# Altium project Wolf-Lite M.PrjPcb (part 2 of 2)

## Sheet WL-CPU.SchDoc
size 420 x 297 mm; Scale: 1:1; DocumentType: Схема электрическая принципиальная; FirstReferrence: UA3REO/R7KBI; SheetNumber: 2; SheetTotal: 12
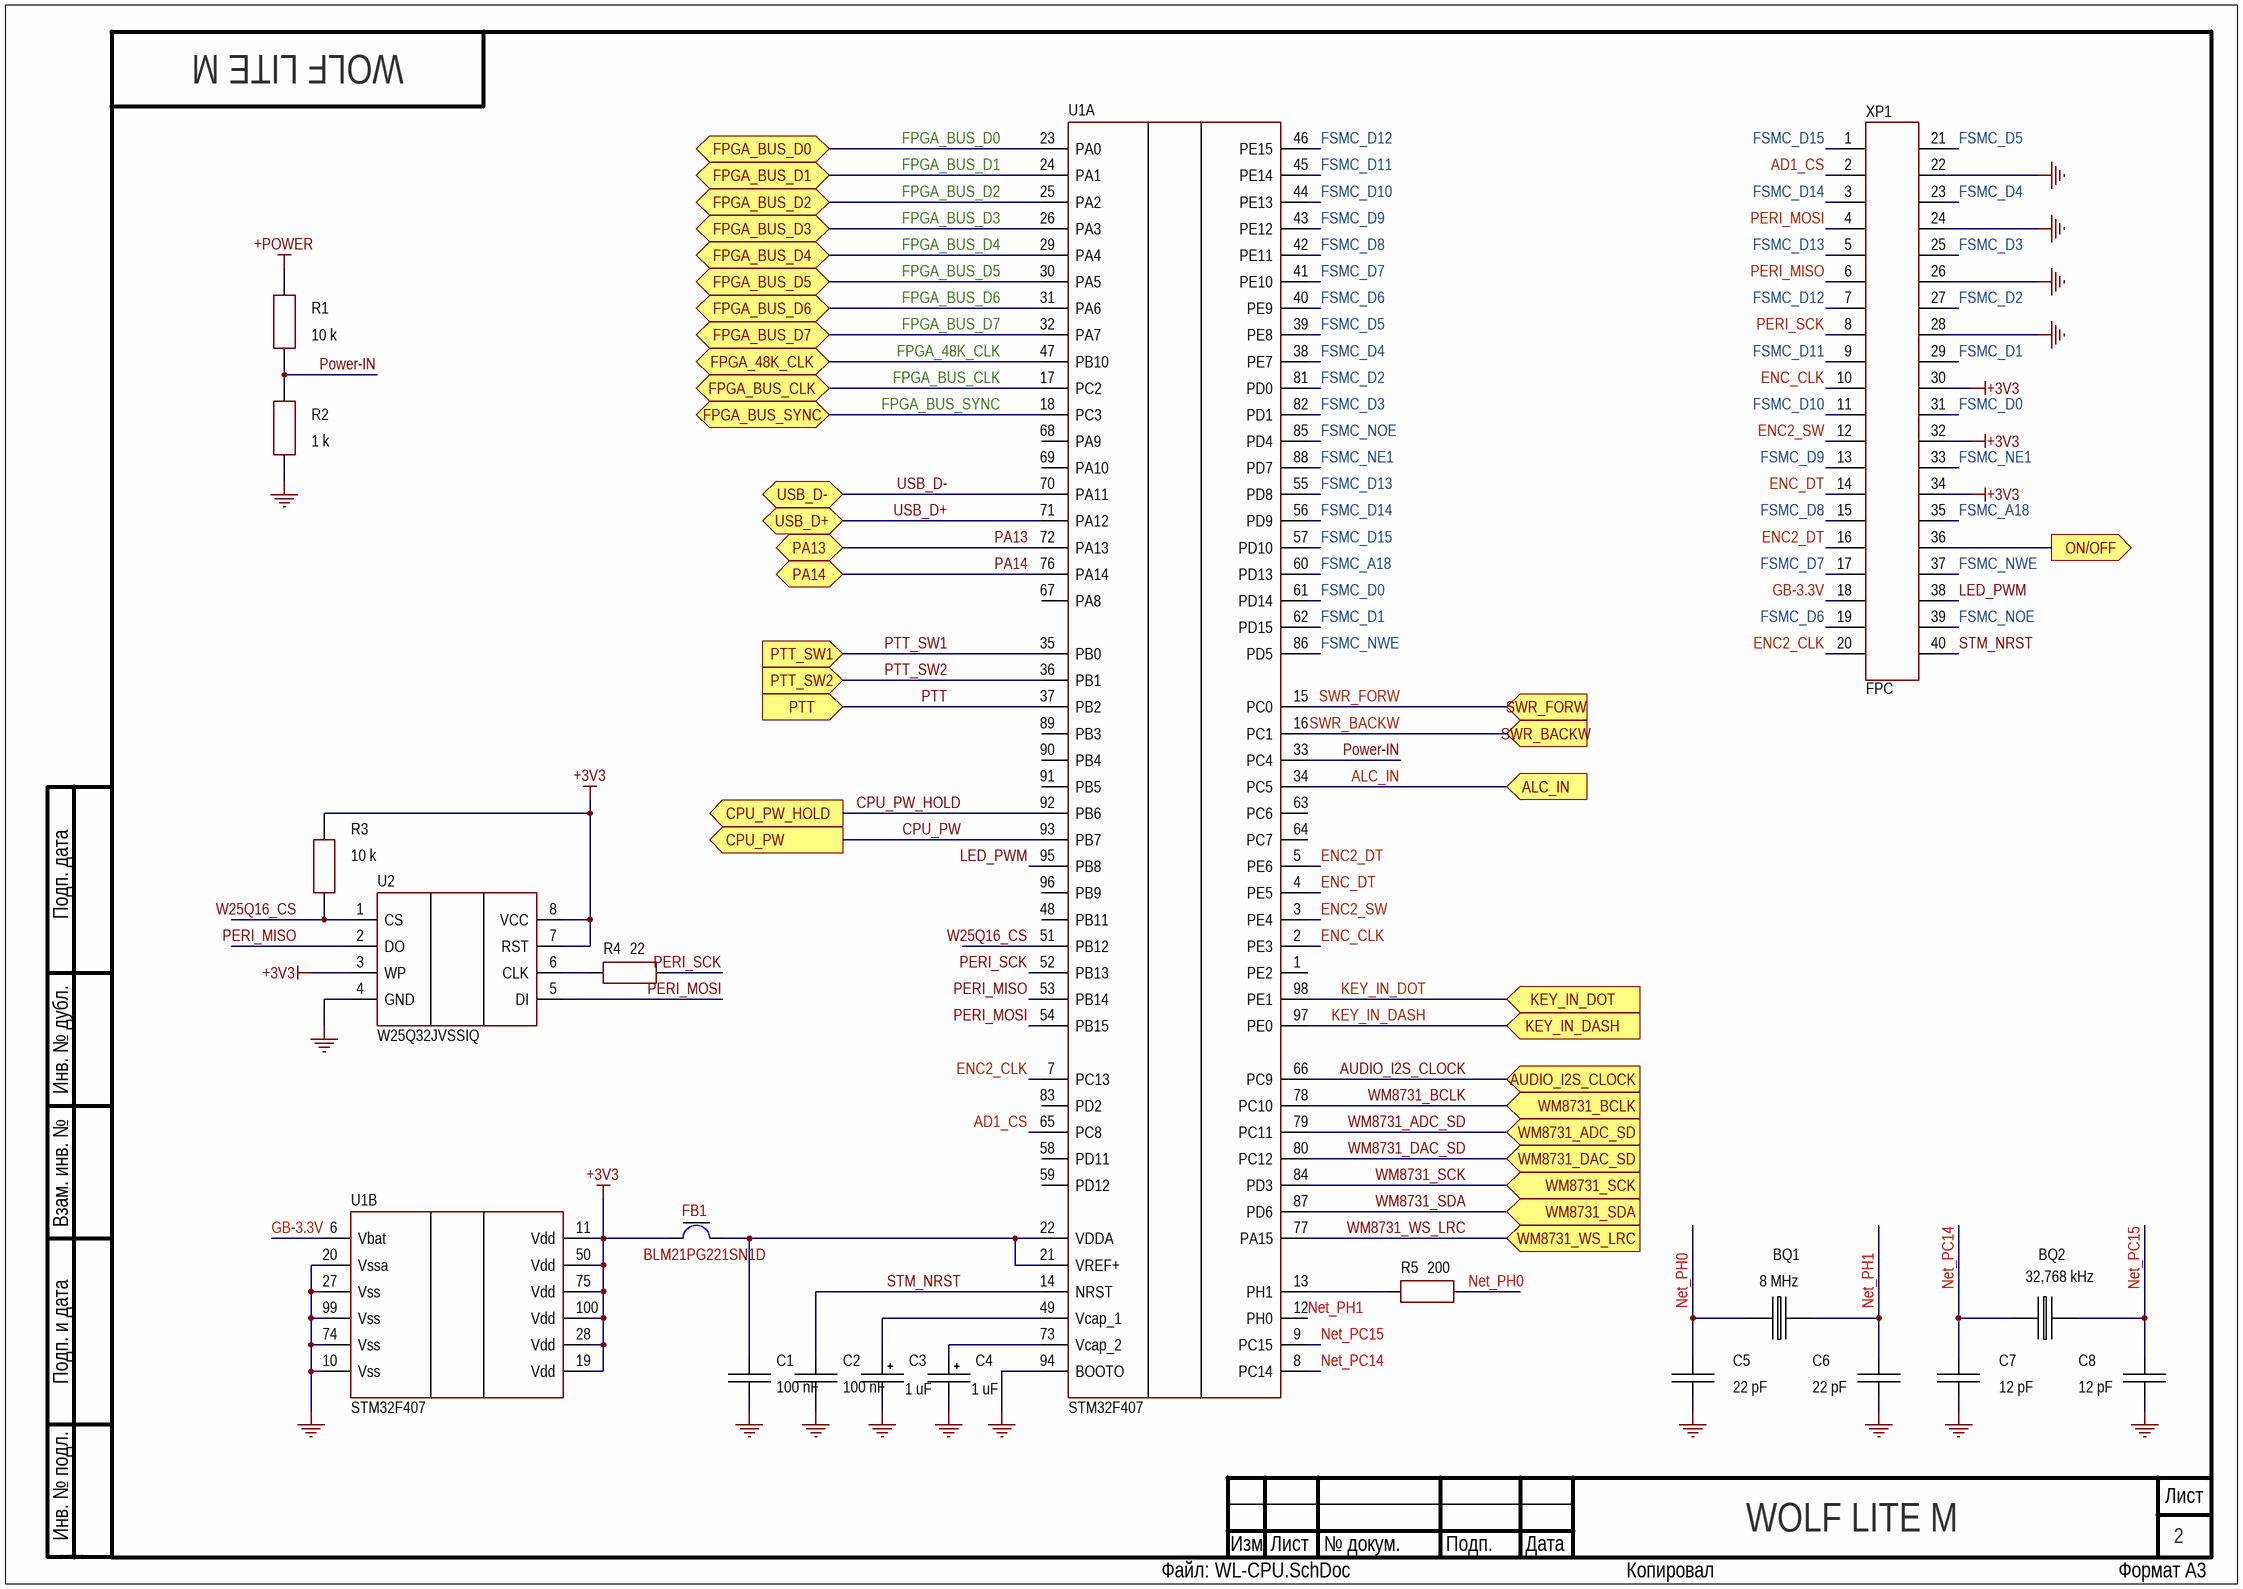
[diagram p6: WL-CPU.SchDoc]

### Parts
BQ1  8 MHz  [SMD-4-CRYSTAL]
BQ2  32,768 kHz  [SOJ-4]
C1  100 nF  [C-0805-0.95]
C2  100 nF  [C-0805-0.95]
C3  1 uF  [CAP-CASE B]
C4  1 uF  [CAP-CASE B]
C5  22 pF  [C-0805-0.7]
C6  22 pF  [C-0805-0.7]
C7  12 pF  [C-0805-0.7]
C8  12 pF  [C-0805-0.7]
FB1  BLM21PG221SN1D  [L-0805]
R1  10 k  [R-0805]
R2  1 k  [R-0805]
R3  10 k  [R-0805]
R4  22  [R-0805]
R5  200  [R-0805]
U1  STM32F407  [LQFP-100]  (parts A,B of 2)
U2  W25Q32JVSSIQ  [SOIC-8-W]
XP1  FPC  [FPC-40-05-V]

### Ports
ALC_IN (in), AUDIO_I2S_CLOCK (in), CPU_PW (out), CPU_PW_HOLD (out), FPGA_48K_CLK (bidir), FPGA_BUS_CLK (bidir), FPGA_BUS_D0 (bidir), FPGA_BUS_D1 (bidir), FPGA_BUS_D2 (bidir), FPGA_BUS_D3 (bidir), FPGA_BUS_D4 (bidir), FPGA_BUS_D5 (bidir), FPGA_BUS_D6 (bidir), FPGA_BUS_D7 (bidir), FPGA_BUS_SYNC (bidir), KEY_IN_DASH (in), KEY_IN_DOT (in), ON/OFF (out), PA13 (bidir), PA14 (bidir), PTT (in), PTT_SW1 (in), PTT_SW2 (in), SWR_BACKW (in), SWR_FORW (in), USB_D+ (bidir), USB_D- (bidir), WM8731_ADC_SD (in), WM8731_BCLK (in), WM8731_DAC_SD (in), WM8731_SCK (in), WM8731_SDA (in), WM8731_WS_LRC (in)

### Nets
+3V3: FB1.2 R3.2 U1.11(Vdd) U1.19(Vdd) U1.28(Vdd) U1.50(Vdd) U1.75(Vdd) U1.100(Vdd) U2.3(WP) U2.7(RST) U2.8(VCC) XP1.30 XP1.32 XP1.34
+Power: R1.2
GND: C1.2 C2.1 C3.2 C4.2 C5.1 C6.1 C7.1 C8.1 R2.1 U1.10(Vss) U1.20(Vssa) U1.27(Vss) U1.74(Vss) U1.94(BOOTO) U1.99(Vss) U2.4(GND) XP1.22 XP1.24 XP1.26 XP1.28
AD1_CS: U1.65(PC8) XP1.2
ALC_IN: U1.34(PC5) ; port ALC_IN
AUDIO_I2S_CLOCK: U1.66(PC9) ; port AUDIO_I2S_CLOCK
CPU_PW: U1.93(PB7) ; port CPU_PW
CPU_PW_HOLD: U1.92(PB6) ; port CPU_PW_HOLD
ENC2_CLK: U1.7(PC13) XP1.20
ENC2_DT: U1.5(PE6) XP1.16
ENC2_SW: U1.3(PE4) XP1.12
ENC_CLK: U1.2(PE3) XP1.10
ENC_DT: U1.4(PE5) XP1.14
FPGA_48K_CLK: U1.47(PB10) ; port FPGA_48K_CLK
FPGA_BUS_CLK: U1.17(PC2) ; port FPGA_BUS_CLK
FPGA_BUS_D0: U1.23(PA0) ; port FPGA_BUS_D0
FPGA_BUS_D1: U1.24(PA1) ; port FPGA_BUS_D1
FPGA_BUS_D2: U1.25(PA2) ; port FPGA_BUS_D2
FPGA_BUS_D3: U1.26(PA3) ; port FPGA_BUS_D3
FPGA_BUS_D4: U1.29(PA4) ; port FPGA_BUS_D4
FPGA_BUS_D5: U1.30(PA5) ; port FPGA_BUS_D5
FPGA_BUS_D6: U1.31(PA6) ; port FPGA_BUS_D6
FPGA_BUS_D7: U1.32(PA7) ; port FPGA_BUS_D7
FPGA_BUS_SYNC: U1.18(PC3) ; port FPGA_BUS_SYNC
FSMC_A18: U1.60(PD13) XP1.35
FSMC_D0: U1.61(PD14) XP1.31
FSMC_D1: U1.62(PD15) XP1.29
FSMC_D2: U1.81(PD0) XP1.27
FSMC_D3: U1.82(PD1) XP1.25
FSMC_D4: U1.38(PE7) XP1.23
FSMC_D5: U1.39(PE8) XP1.21
FSMC_D6: U1.40(PE9) XP1.19
FSMC_D7: U1.41(PE10) XP1.17
FSMC_D8: U1.42(PE11) XP1.15
FSMC_D9: U1.43(PE12) XP1.13
FSMC_D10: U1.44(PE13) XP1.11
FSMC_D11: U1.45(PE14) XP1.9
FSMC_D12: U1.46(PE15) XP1.7
FSMC_D13: U1.55(PD8) XP1.5
FSMC_D14: U1.56(PD9) XP1.3
FSMC_D15: U1.57(PD10) XP1.1
FSMC_NE1: U1.88(PD7) XP1.33
FSMC_NOE: U1.85(PD4) XP1.39
FSMC_NWE: U1.86(PD5) XP1.37
GB-3.3V: U1.6(Vbat) XP1.18
KEY_IN_DASH: U1.97(PE0) ; port KEY_IN_DASH
KEY_IN_DOT: U1.98(PE1) ; port KEY_IN_DOT
LED_PWM: U1.95(PB8) XP1.38
Net_PC14: BQ2.1 C7.2 U1.8(PC14)
Net_PC15: BQ2.4 C8.2 U1.9(PC15)
Net_PH0: BQ1.1 C5.2 R5.1
Net_PH1: BQ1.4 C6.2 U1.12(PH0)
ON/OFF: XP1.36 ; port ON/OFF
PA13: U1.72(PA13) ; port PA13
PA14: U1.76(PA14) ; port PA14
PERI_MISO: U1.53(PB14) U2.2(DO) XP1.6
PERI_MOSI: U1.54(PB15) U2.5(DI) XP1.4
PERI_SCK: R4.2 U1.52(PB13) XP1.8
Power-IN: R1.1 R2.2 U1.33(PC4)
PTT: U1.37(PB2) ; port PTT
PTT_SW1: U1.35(PB0) ; port PTT_SW1
PTT_SW2: U1.36(PB1) ; port PTT_SW2
STM_NRST: C2.2 U1.14(NRST) XP1.40
SWR_BACKW: U1.16(PC1) ; port SWR_BACKW
SWR_FORW: U1.15(PC0) ; port SWR_FORW
USB_D+: U1.71(PA12) ; port USB_D+  [project net D_P]
USB_D-: U1.70(PA11) ; port USB_D-  [project net D_N]
W25Q16_CS: R3.1 U1.51(PB12) U2.1(CS)
WM8731_ADC_SD: U1.79(PC11) ; port WM8731_ADC_SD
WM8731_BCLK: U1.78(PC10) ; port WM8731_BCLK
WM8731_DAC_SD: U1.80(PC12) ; port WM8731_DAC_SD
WM8731_SCK: U1.84(PD3) ; port WM8731_SCK
WM8731_SDA: U1.87(PD6) ; port WM8731_SDA
WM8731_WS_LRC: U1.77(PA15) ; port WM8731_WS_LRC
NetC1_1: C1.1 FB1.1 U1.21(VREF+) U1.22(VDDA)
NetC3_1: C3.1 U1.49(Vcap_1)
NetC4_1: C4.1 U1.73(Vcap_2)
NetR4_1: R4.1 U2.6(CLK)
NetR5_2: R5.2 U1.13(PH1)

Not connected (* = marked no-connect by the designer): U1 1(PE2) 48(PB11) 58(PD11) 59(PD12) 63(PC6) 64(PC7) 67(PA8) 68(PA9) 69(PA10) 83(PD2) 89(PB3) 90(PB4) 91(PB5) 96(PB9)

### Notes on the sheet
- Подп. дата
- Инв. № дубл.
- Взам. инв. №
- Подп. и дата
- Инв. № подл.
- Изм.
- Лист
- № докум.
- Подп.
- Дата
- ALTIUM GOSTBOM2.0 KEV
- Файл:
- Копировал
- Формат А3

### Library data of the parts
BQ1 = ABM3B-8.000MHZ-B2-T: Manufacturer: Abracon LLC; Type: Кварцевый резонатор; Part Number: ABM3B-8.000MHZ-B2-T; Value: 8 MHz; Case: SMD-4-CRYSTAL; Operating Temperature: −20°C ... 70°C
BQ2 = ABS25-32.768KHZ-T: Manufacturer: Abracon LLC; Type: Кварцевый резонатор; Part Number: ABS25-32.768KHZ-T; Value: 32,768 kHz; Case: SOJ-4; Operating Temperature: −40°C ... 85°C
C1 C2 = CC0805KRX7R9BB104: as C81 on sheet WL-POWER; Part Number: CC0805KRX7R9BB104; Units: nF; Case: 0805; Operating Temperature: -55 ... 125 °C; Series: CC; Value+Units: 100 nF; ValueSCH: 100 nF; ( Series - Case - Dielectric -  Voltage - Value+Units Tolerance: ( CC - 0805 - X7R - 50 V - 100 nF ±10% )
C3 C4 = EEE-1HA010SR: Manufacturer: Panasonic Electronic Components; Type: Конденсатор; Value: 1; Tolerance: ±20%; Voltage: 50 V; CommentDOC: ( S - 50 V - 1  uF  ±20% ); Part Number: EEE-1HA010SR; Units: uF; Case: 4x5.4; Operating Temperature: -40 ... 85 °C; Series: S; ValueSCH: 1 uF; ( Series - Voltage - Value  Units  Tolerance ): ( S - 50 V - 1  uF  ±20% )
C5 C6 = CC0805JRNPO9BN220: Manufacturer: Yageo; Value: 22; Type: Конденсатор; Dielectric: NPO; Tolerance: ±5%; Voltage: 50 V; CommentDOC: ( CC - 0805 - NPO - 50 V - 22 pF ±5% ); Part Number: CC0805JRNPO9BN220; Units: pF; Case: 0805; Operating Temperature: -55 ... 125 °C; Series: CC; Value+Units: 22 pF; ValueSCH: 22 pF; ( Series - Case - Dielectric -  Voltage - Value+Units Tolerance: ( CC - 0805 - NPO - 50 V - 22 pF ±5% )
C7 C8 = CC0805JRNPO9BN120: Manufacturer: Yageo; Value: 12; Type: Конденсатор; Dielectric: NPO; Tolerance: ±5%; Voltage: 50 V; CommentDOC: ( CC - 0805 - NPO - 50 V - 12 pF ±5% ); Part Number: CC0805JRNPO9BN120; Units: pF; Case: 0805; Operating Temperature: -55 ... 125 °C; Series: CC; Value+Units: 12 pF; ValueSCH: 12 pF; ( Series - Case - Dielectric -  Voltage - Value+Units Tolerance: ( CC - 0805 - NPO - 50 V - 12 pF ±5% )
FB1 = BLM21PG221SN1D: as FB2 on sheet WL-ADC; Part Number: BLM21PG221SN1D; Series: EMIFIL; Case: 0805; ValueSCH: BLM21PG221SN1D; Operating Temperature: −55°C ... 125°C
R1 R3 = RC0805JR-0710KL: as R47 on sheet WL-POWER; Type: Резистор; Part Number: RC0805JR-0710KL; Case: 0805; Operating Temperature: -55°C ... 155°C; ValueSCH: 10 k; Series: RC
R2 = RC0805JR-071KL: as R12 on sheet WL-ADC; Type: Резистор; Part Number: RC0805JR-071KL; Case: 0805; Operating Temperature: -55°C ... 155°C; ValueSCH: 1 k; Series: RC
R4 = RC0805JR-0722RL: as R19 on sheet WL-DAC; Value: 22; Type: Резистор; Part Number: RC0805JR-0722RL; Case: 0805; Operating Temperature: -55°C ... 155°C; ValueSCH: 22; Series: RC
R5 = RC0805JR-07200RL: Manufacturer: Yageo; Power: 0,125 W; Units: Ohm; Tolerance: ±5%; Operating Voltage: 150 V; Value+Units: 200 Ohm; CommentDOC: ( RC - 0805 - 0,125 W - 200 Ohm  ±5% ); Value: 200; Type: Резистор; Part Number: RC0805JR-07200RL; Case: 0805; Operating Temperature: -55°C ... 155°C; ValueSCH: 200; Series: RC
U1 = STM32F407VGT6: Manufacturer: STMicroelectronics; Operation Frequency: 168 MHz; Prog Interface: SWD; Part Number: STM32F407VGT6; Case: LQFP-100; Operating Temperature: -40°С ... 85°С; Type: Микроконтроллер
U2 = W25Q32JVSSIQ: IC FLASH 32MBIT SPI/QUAD; Manufacturer: Winbond Electronics; ValueSCH: W25Q32; Voltage  Supply: +2,7 V … 3,6 V; Part Number: W25Q32JVSSIQ; Function: IC FLASH 32MBIT SPI/QUAD; Case: SOIC-8-W; Operating Temperature: -40°С ... 85°С; Type: Микросхема
XP1 = AFC11-S40ICC-00: Manufacturer: JUSHUO; Type: Вилка; Part Number: AFC11-S40ICC-00

## Sheet WL-AUDIO.SchDoc
size 420 x 297 mm; Scale: 1:1; DocumentType: Схема электрическая принципиальная; FirstReferrence: UA3REO/R7KBI; SheetNumber: 6; SheetTotal: 12
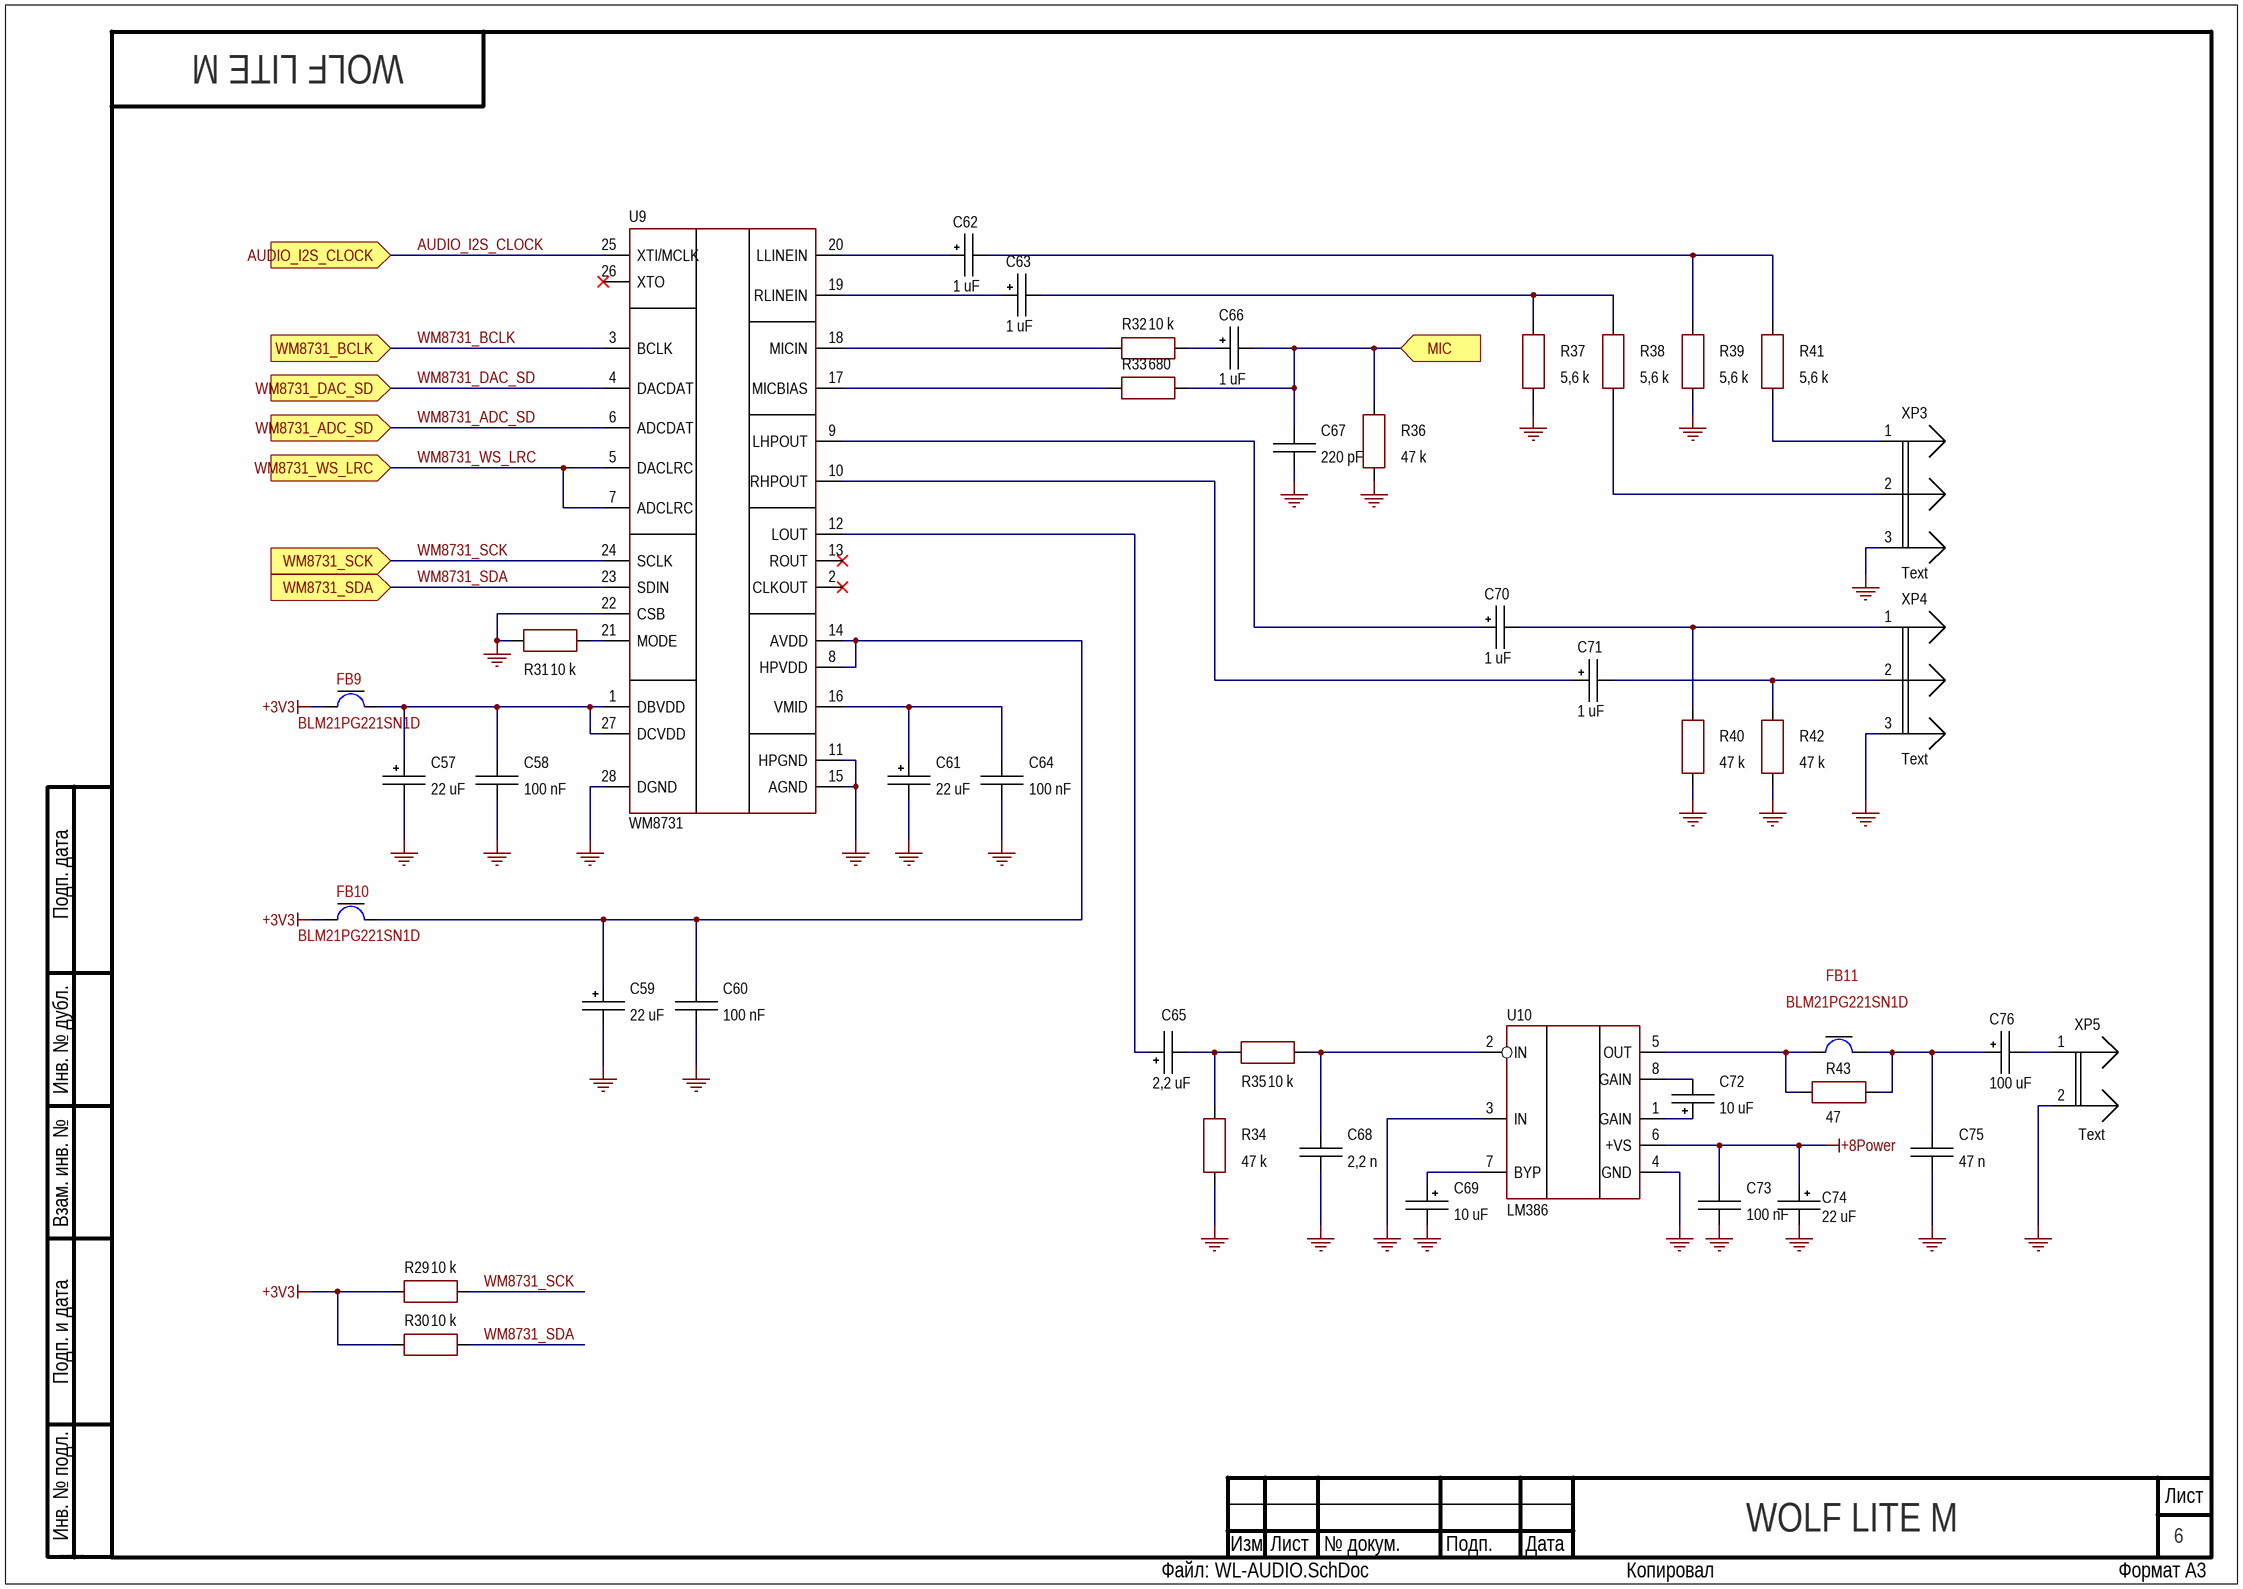
[diagram p7: WL-AUDIO.SchDoc]

### Parts
C57  22 uF  [CAP-CASE B]
C58  100 nF  [C-0805-0.95]
C59  22 uF  [CAP-CASE B]
C60  100 nF  [C-0805-0.95]
C61  22 uF  [CAP-CASE B]
C62  1 uF  [CAP-CASE B]
C63  1 uF  [CAP-CASE B]
C64  100 nF  [C-0805-0.95]
C65  2,2 uF  [CAP-CASE B]
C66  1 uF  [CAP-CASE B]
C67  220 pF  [C-0805-0.7]
C68  2,2 n  [C-0805-0.7]
C69  10 uF  [CAP-CASE B]
C70  1 uF  [CAP-CASE B]
C71  1 uF  [CAP-CASE B]
C72  10 uF  [CAP-CASE B]
C73  100 nF  [C-0805-0.95]
C74  22 uF  [CAP-CASE B]
C75  47 n  [C-0805-0.95]
C76  100 uF  [CAP-CASE E]
FB9  BLM21PG221SN1D  [L-0805]
FB10  BLM21PG221SN1D  [L-0805]
FB11  BLM21PG221SN1D  [L-0805]
R29  10 k  [R-0805]
R30  10 k  [R-0805]
R31  10 k  [R-0805]
R32  10 k  [R-0805]
R33  680  [R-0805]
R34  47 k  [R-0805]
R35  10 k  [R-0805]
R36  47 k  [R-0805]
R37  5,6 k  [R-0805]
R38  5,6 k  [R-0805]
R39  5,6 k  [R-0805]
R40  47 k  [R-0805]
R41  5,6 k  [R-0805]
R42  47 k  [R-0805]
R43  47  [R-0805]
U9  WM8731  [SSOP-28]
U10  LM386  [SOIC-8]
XP3  Text  [61900311121]
XP4  Text  [61900311121]
XP5  Text  [61900211121]

### Ports
AUDIO_I2S_CLOCK (in), MIC (in), WM8731_ADC_SD (in), WM8731_BCLK (in), WM8731_DAC_SD (in), WM8731_SCK (in), WM8731_SDA (in), WM8731_WS_LRC (in)

### Nets
+3V3: FB9.2 FB10.2 R29.1 R30.1
+8Power: C73.1 C74.1 U10.6(+VS)
GND: C57.2 C58.2 C59.2 C60.2 C61.2 C64.2 C67.2 C68.1 C69.2 C73.2 C74.2 C75.1 R31.2 R34.1 R36.1 R37.1 R39.1 R40.1 R42.1 U9.11(HPGND) U9.15(AGND) U9.22(CSB) U9.28(DGND) U10.3(IN) U10.4(GND) XP3.3 XP4.3 XP5.2
AUDIO_I2S_CLOCK: U9.25(XTI/MCLK) ; port AUDIO_I2S_CLOCK
MIC: C66.2 C67.1 R33.2 R36.2 ; port MIC
WM8731_ADC_SD: U9.6(ADCDAT) ; port WM8731_ADC_SD
WM8731_BCLK: U9.3(BCLK) ; port WM8731_BCLK
WM8731_DAC_SD: U9.4(DACDAT) ; port WM8731_DAC_SD
WM8731_SCK: R29.2 U9.24(SCLK) ; port WM8731_SCK
WM8731_SDA: R30.2 U9.23(SDIN) ; port WM8731_SDA
WM8731_WS_LRC: U9.5(DACLRC) U9.7(ADCLRC) ; port WM8731_WS_LRC
NetC57_1: C57.1 C58.1 FB9.1 U9.1(DBVDD) U9.27(DCVDD)
NetC59_1: C59.1 C60.1 FB10.1 U9.8(HPVDD) U9.14(AVDD)
NetC61_1: C61.1 C64.1 U9.16(VMID)
NetC62_1: C62.1 U9.20(LLINEIN)
NetC62_2: C62.2 R39.2 R41.1
NetC63_1: C63.1 U9.19(RLINEIN)
NetC63_2: C63.2 R37.2 R38.1
NetC65_1: C65.1 U9.12(LOUT)
NetC65_2: C65.2 R34.2 R35.2
NetC66_1: C66.1 R32.2
NetC68_2: C68.2 R35.1 U10.2(IN)
NetC69_1: C69.1 U10.7(BYP)
NetC70_1: C70.1 U9.9(LHPOUT)
NetC70_2: C70.2 R40.2 XP4.1
NetC71_1: C71.1 U9.10(RHPOUT)
NetC71_2: C71.2 R42.2 XP4.2
NetC72_1: C72.1 U10.1(GAIN)
NetC72_2: C72.2 U10.8(GAIN)
NetC75_2: C75.2 C76.1 FB11.2 R43.2
NetC76_2: C76.2 XP5.1
NetFB11_1: FB11.1 R43.1 U10.5(OUT)
NetR31_1: R31.1 U9.21(MODE)
NetR32_1: R32.1 U9.18(MICIN)
NetR33_1: R33.1 U9.17(MICBIAS)
NetR38_2: R38.2 XP3.2
NetR41_2: R41.2 XP3.1

Not connected (* = marked no-connect by the designer): U9 2(CLKOUT)* 13(ROUT)* 26(XTO)*

### Notes on the sheet
- Подп. дата
- Инв. № дубл.
- Взам. инв. №
- Подп. и дата
- Инв. № подл.
- Изм.
- Лист
- № докум.
- Подп.
- Дата
- ALTIUM GOSTBOM2.0 KEV
- Файл:
- Копировал
- Формат А3

### Library data of the parts
C57 C59 C61 = EEE-1CA220WAR: Manufacturer: Panasonic Electronic Components; Type: Конденсатор; Value: 22; Tolerance: ±20%; Voltage: 16 V; Part Number: EEE-1CA220WAR; Units: uF; Case: 4x5.4; Operating Temperature: -40 ... 85 °C; Series: S; ValueSCH: 22 uF
C58 C60 C64 C73 = CC0805KRX7R9BB104: as C81 on sheet WL-POWER; Part Number: CC0805KRX7R9BB104; Units: nF; Case: 0805; Operating Temperature: -55 ... 125 °C; Series: CC; Value+Units: 100 nF; ValueSCH: 100 nF; ( Series - Case - Dielectric -  Voltage - Value+Units Tolerance: ( CC - 0805 - X7R - 50 V - 100 nF ±10% )
C62 C63 C66 C70 C71 = EEE-1HA010SR: as C3 on sheet WL-CPU; Part Number: EEE-1HA010SR; Units: uF; Case: 4x5.4; Operating Temperature: -40 ... 85 °C; Series: S; ValueSCH: 1 uF; ( Series - Voltage - Value  Units  Tolerance ): ( S - 50 V - 1  uF  ±20% )
C65 = EEE-1HA2R2AR: Manufacturer: Panasonic Electronic Components; Type: Конденсатор; Value: 2,2; Tolerance: ±20%; Voltage: 50 V; Part Number: EEE-1HA2R2AR; Units: uF; Case: 4x5.5; Operating Temperature: -40 ... 85 °C; Series: S; ValueSCH: 2,2 uF
C67 = CC0805JRNPO9BN221: Manufacturer: Yageo; Value: 220; Type: Конденсатор; Dielectric: NPO; Tolerance: ±5%; Voltage: 50 V; CommentDOC: ( CC - 0805 - NPO - 50 V - 220 pF ±5% ); Part Number: CC0805JRNPO9BN221; Units: pF; Case: 0805; Operating Temperature: -55 ... 125 °C; Series: CC; Value+Units: 220 pF; ValueSCH: 220 pF; ( Series - Case - Dielectric -  Voltage - Value+Units Tolerance: ( CC - 0805 - NPO - 50 V - 220 pF ±5% )
C68 = CC0805KRX7R9BB222: Manufacturer: Yageo; Type: Конденсатор; Dielectric: X7R; Value: 2,2; Units: nF; Tolerance: ±10%; Voltage: 50 V; Value+Units: 2,2 nF; CommentDOC: ( CC - 0805 - X7R - 50 V - 2,2 nF ±10% ); Part Number: CC0805KRX7R9BB222; Case: 0805; Operating Temperature: -55 ... 125 °C; Series: CC; ValueSCH: 2,2 n; ( Series - Case - Dielectric -  Voltage - Value+Units Tolerance: ( CC - 0805 - X7R - 50 V - 2,2 nF ±10% )
C69 C72 = EEE-1EA100WR: Manufacturer: Panasonic Electronic Components; Type: Конденсатор; Value: 10; Tolerance: ±20%; Voltage: 25 V; CommentDOC: ( S - 25 V - 10  uF  ±20% ); Part Number: EEE-1EA100WR; Units: uF; Case: 4x5.4; Operating Temperature: -40 ... 85 °C; Series: S; ValueSCH: 10 uF; ( Series - Voltage - Value  Units  Tolerance ): ( S - 25 V - 10  uF  ±20% )
C74 = EEE-1CA220WAR: Manufacturer: Panasonic Electronic Components; Type: Конденсатор; Value: 22; Tolerance: ±20%; Voltage: 16 V; CommentDOC: ( S - 16 V - 22  uF  ±20% ); Part Number: EEE-1CA220WAR; Units: uF; Case: 4x5.4; Operating Temperature: -40 ... 85 °C; Series: S; ValueSCH: 22 uF; ( Series - Voltage - Value  Units  Tolerance ): ( S - 16 V - 22  uF  ±20% )
C75 = CC0805KRX7R9BB473: Manufacturer: Yageo; Type: Конденсатор; Dielectric: X7R; Value: 47; Units: nF; Tolerance: ±10%; Voltage: 50 V; Value+Units: 47 nF; CommentDOC: ( CC - 0805 - X7R - 50 V - 47 nF ±10% ); Part Number: CC0805KRX7R9BB473; Case: 0805; Operating Temperature: -55 ... 125 °C; Series: CC; ValueSCH: 47 n; ( Series - Case - Dielectric -  Voltage - Value+Units Tolerance: ( CC - 0805 - X7R - 50 V - 47 nF ±10% )
C76 = EEE-1CA101P: Manufacturer: Panasonic Electronic Components; Type: Конденсатор; Value: 100; Tolerance: ±20%; Voltage: 16 V; CommentDOC: ( S - 16 V - 100  uF  ±20% ); Part Number: EEE-1CA101P; Units: uF; Case: 8x6.2; Operating Temperature: -40 ... 85 °C; Series: S; ValueSCH: 100 uF; ( Series - Voltage - Value  Units  Tolerance ): ( S - 16 V - 100  uF  ±20% )
FB9-FB11 = BLM21PG221SN1D: as FB2 on sheet WL-ADC; Part Number: BLM21PG221SN1D; Series: EMIFIL; Case: 0805; ValueSCH: BLM21PG221SN1D; Operating Temperature: −55°C ... 125°C
R29-R32 R35 = RC0805JR-0710KL: as R47 on sheet WL-POWER; Type: Резистор; Part Number: RC0805JR-0710KL; Case: 0805; Operating Temperature: -55°C ... 155°C; ValueSCH: 10 k; Series: RC
R33 = RC0805JR-07680RL: Manufacturer: Yageo; Power: 0,125 W; Units: Ohm; Tolerance: ±5%; Operating Voltage: 150 V; Value+Units: 680 Ohm; CommentDOC: ( RC - 0805 - 0,125 W - 680 Ohm  ±5% ); Value: 680; Type: Резистор; Part Number: RC0805JR-07680RL; Case: 0805; Operating Temperature: -55°C ... 155°C; ValueSCH: 680; Series: RC
R34 = RC0805JR-0747KL: Manufacturer: Yageo; Power: 0,125 W; Value: 47; Units: kOhm; Tolerance: ±5%; Operating Voltage: 150 V; Value+Units: 47 kOhm; CommentDOC: ( RC - 0805 - 0,125 W - 47 kOhm  ±5% ); Type: Резистор; Part Number: RC0805JR-0747KL; Case: 0805; Operating Temperature: -55°C ... 155°C; ValueSCH: 47 k; Series: RC
R36 R40 R42 = RC0805JR-0747KL: Manufacturer: Yageo; Value: 47; Power: 0,125 W; Units: kOhm; Tolerance: ±5%; Operating Voltage: 150 V; Value+Units: 47 kOhm; CommentDOC: ( RC - 0805 - 0,125 W - 47 kOhm  ±5% ); Type: Резистор; Part Number: RC0805JR-0747KL; Case: 0805; Operating Temperature: -55°C ... 155°C; ValueSCH: 47 k; Series: RC
R37-R39 R41 = RC0805JR-075K6L: Manufacturer: Yageo; Value: 5,6; Power: 0,125 W; Units: kOhm; Tolerance: ±5%; Operating Voltage: 150 V; Value+Units: 5,6 kOhm; CommentDOC: ( RC - 0805 - 0,125 W - 5,6 kOhm  ±5% ); Type: Резистор; Part Number: RC0805JR-075K6L; Case: 0805; Operating Temperature: -55°C ... 155°C; ValueSCH: 5,6 k; Series: RC
R43 = RC0805JR-0747RL: Manufacturer: Yageo; Power: 0,125 W; Units: Ohm; Tolerance: ±5%; Operating Voltage: 150 V; Value+Units: 47 Ohm; CommentDOC: ( RC - 0805 - 0,125 W - 47 Ohm  ±5% ); Type: Резистор; Part Number: RC0805JR-0747RL; Value: 47; Case: 0805; Operating Temperature: -55°C ... 155°C; ValueSCH: 47; Series: RC
U9 = WM8731SEDS/RV: IC CODEC; Manufacturer: Cirrus Logic Inc.; Voltage  Supply: +2,7 V … 3,6 V / +1,42 V … 3,6 V; Part Number: WM8731SEDS/RV; ValueSCH: WM8731; Function: IC CODEC; Case: SSOP-28; Operating Temperature: -40°С ... 85°С; Type: Микросхема
U10 = LM386M-1/NOPB: IC AMP CLASS AB MONO; Manufacturer: Texas Instruments; Function: IC AMP CLASS AB MONO 325 mW; Voltage  Supply: 4 … 12 V; Type: Микросхема; Part Number: LM386M-1/NOPB; Case: SOIC-8; Operating Temperature: 0 ... 70 °C
XP3 XP4 = 61900311121: Manufacturer: Würth Elektronik; Pitch: 2,54 mm; Functional Analog: WF-3; Type: Вилка; Part Number: 61900311121; Series: WE-WTB; Number of Pins: 3; Operating Temperature: −40°C ... 105°C
XP5 = 61900211121: Manufacturer: Würth Elektronik; Pitch: 2,54 mm; Functional Analog: WF-2; Type: Вилка; Part Number: 61900211121; Series: WE-WTB; Number of Pins: 2; Operating Temperature: −40°C ... 105°C

## Sheet WL-CONTROL.SchDoc
size 420 x 297 mm; Scale: 1:1; DocumentType: Схема электрическая принципиальная; FirstReferrence: UA3REO/R7KBI; DocumentNumber: 9; SheetNumber: 7; SheetTotal: 12
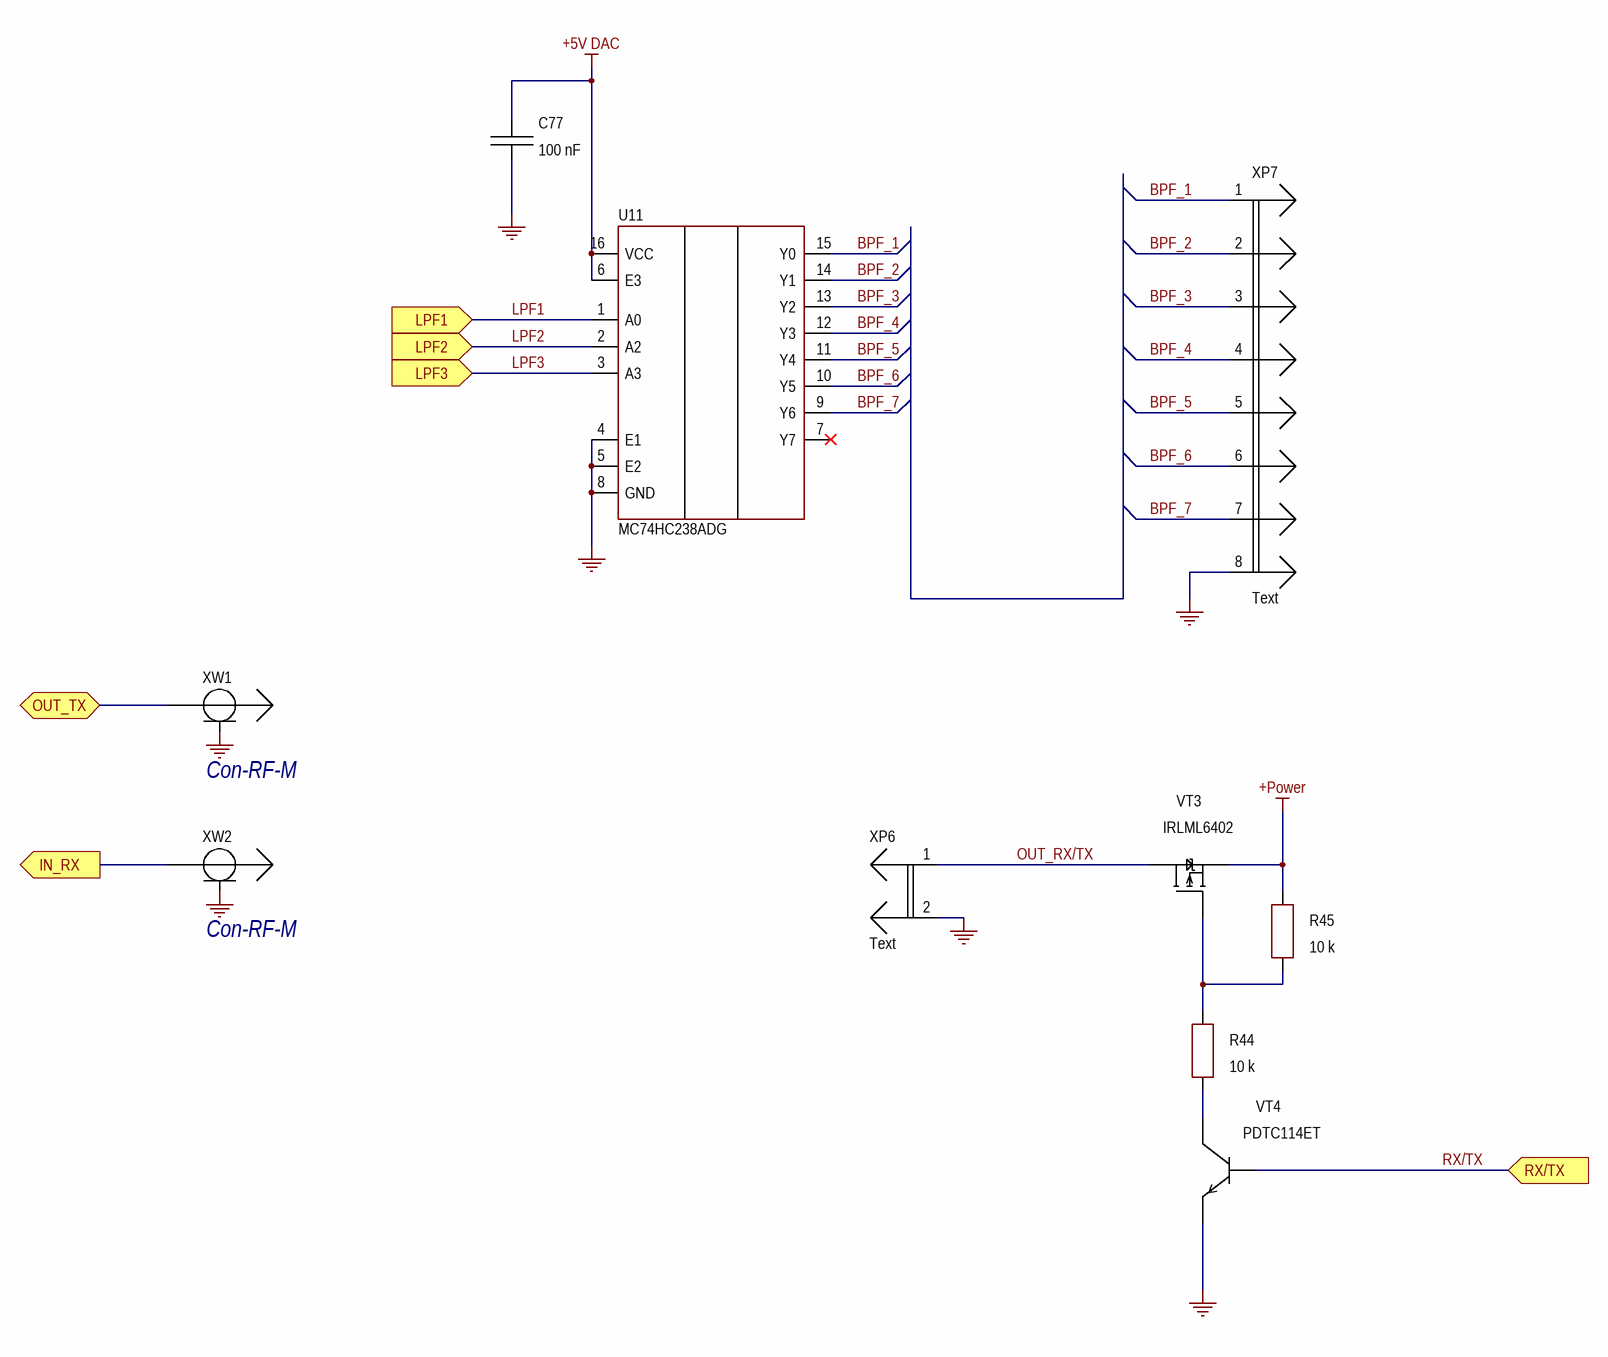
[diagram p8: WL-CONTROL.SchDoc]

### Parts
C77  100 nF  [C-0805-0.95]
R44  10 k  [R-0805]
R45  10 k  [R-0805]
U11  MC74HC238ADG  [SOIC-16]
VT3  IRLML6402  [SOT-23]
VT4  PDTC114ET  [SOT-23]
XP6  Text  [61900211121]
XP7  Text  [CON PLD-8]
XW1  Con-RF-M  [A-1JB]
XW2  Con-RF-M  [A-1JB]

### Ports
IN_RX (out), LPF1 (in), LPF2 (in), LPF3 (in), OUT_TX (bidir), RX/TX (in)

### Nets
+5V DAC: C77.1 U11.6(E3) U11.16(VCC)
+Power: R45.2 VT3.2(S)
GND: C77.2 U11.4(E1) U11.5(E2) U11.8(GND) VT4.2 XP6.2 XP7.8 XW1.2 XW2.2
BPF_1: U11.15(Y0) XP7.1
BPF_2: U11.14(Y1) XP7.2
BPF_3: U11.13(Y2) XP7.3
BPF_4: U11.12(Y3) XP7.4
BPF_5: U11.11(Y4) XP7.5
BPF_6: U11.10(Y5) XP7.6
BPF_7: U11.9(Y6) XP7.7
LPF1: U11.1(A0) ; port LPF1
LPF2: U11.2(A2) ; port LPF2
LPF3: U11.3(A3) ; port LPF3
OUT_RX/TX: VT3.3(D) XP6.1
RX/TX: VT4.1 ; port RX/TX
NetC131_1: XW2.1 ; port IN_RX
NetR44_1: R44.1 VT4.3
NetR44_2: R44.2 R45.1 VT3.1(G)
NetT4_3: XW1.1 ; port OUT_TX

Not connected (* = marked no-connect by the designer): U11 7(Y7)*

### Notes on the sheet
- Подп. дата
- Инв. № дубл.
- Взам. инв. №
- Подп. и дата
- Инв. № подл.
- Изм.
- Лист
- № докум.
- Подп.
- Дата
- ALTIUM GOSTBOM2.0 KEV
- Файл:
- Копировал
- Формат А3

### Library data of the parts
C77 = CC0805KRX7R9BB104: as C81 on sheet WL-POWER; Part Number: CC0805KRX7R9BB104; Units: nF; Case: 0805; Operating Temperature: -55 ... 125 °C; Series: CC; Value+Units: 100 nF; ValueSCH: 100 nF; ( Series - Case - Dielectric -  Voltage - Value+Units Tolerance: ( CC - 0805 - X7R - 50 V - 100 nF ±10% )
R44 R45 = RC0805JR-0710KL: as R47 on sheet WL-POWER; Type: Резистор; Part Number: RC0805JR-0710KL; Case: 0805; Operating Temperature: -55°C ... 155°C; ValueSCH: 10 k; Series: RC
U11 = MC74HC238ADG: IC DECODER/DEMUX 1X3:8; Manufacturer: ON Semiconductor; Voltage  Supply: +2 V … 6 V; Type: Микросхема; Part Number: MC74HC238ADG; Function: IC DECODER/DEMUX 1X3:8; Case: SOIC-16; Operating Temperature: -55 ... 125 °C
VT3 = IRLML6402TRPBF: Manufacturer: Infineon Technologies; Type: Транзистор; D-S Voltage max: 20 V; Drain Current max: 3,7 A; Total Power Dissipation: 1,3 W; Rds On (Max): 65 mOhm; Vgs (Max): ±12 V; Gate Threshold Voltage: 1,2 V; Input Capacitance: 633 pF; Part Number: IRLML6402TRPBF; ValueSCH: IRLML6402; Operating Temperature: -55°C ... 150°C
VT4 = PDTC114ET,215: Manufacturer: Nexperia USA Inc.; Type: Транзистор; Uce max: 50 V; Ice max: 100 mA; Total Power Dissipation: 250 mW; F max: 230 MHz; Part Number: PDTC114ET,215; ValueSCH: PDTC114ET; DC Current Gain: -; Operating Temperature: -65°C …  150°C
XP6 = 61900211121: as XP5 on sheet WL-AUDIO; Type: Вилка; Part Number: 61900211121; Series: WE-WTB; Number of Pins: 2; Operating Temperature: −40°C ... 105°C
XP7 = PLD-8: Part Number: PLD-8; Manufacturer: Connfly Electronic Co., Ltd.; Type: Вилка
XW1 XW2 = A-1JB: Manufacturer: Amphenol RF; Gender: Male; Type: Вилка; Part Number: A-1JB; Series: AMC; Mounting Type: Surface Mount; PCB   Thickness: -; Operating Temperature: -40°C ... 90°C

## Sheet WL-BPF.SchDoc
size 594 x 420 mm; Scale: 1:1; DocumentType: Схема электрическая принципиальная; FirstReferrence: UA3REO/R7KBI; ListNumber: 2; DocumentNumber: 10; SheetNumber: 11; SheetTotal: 12
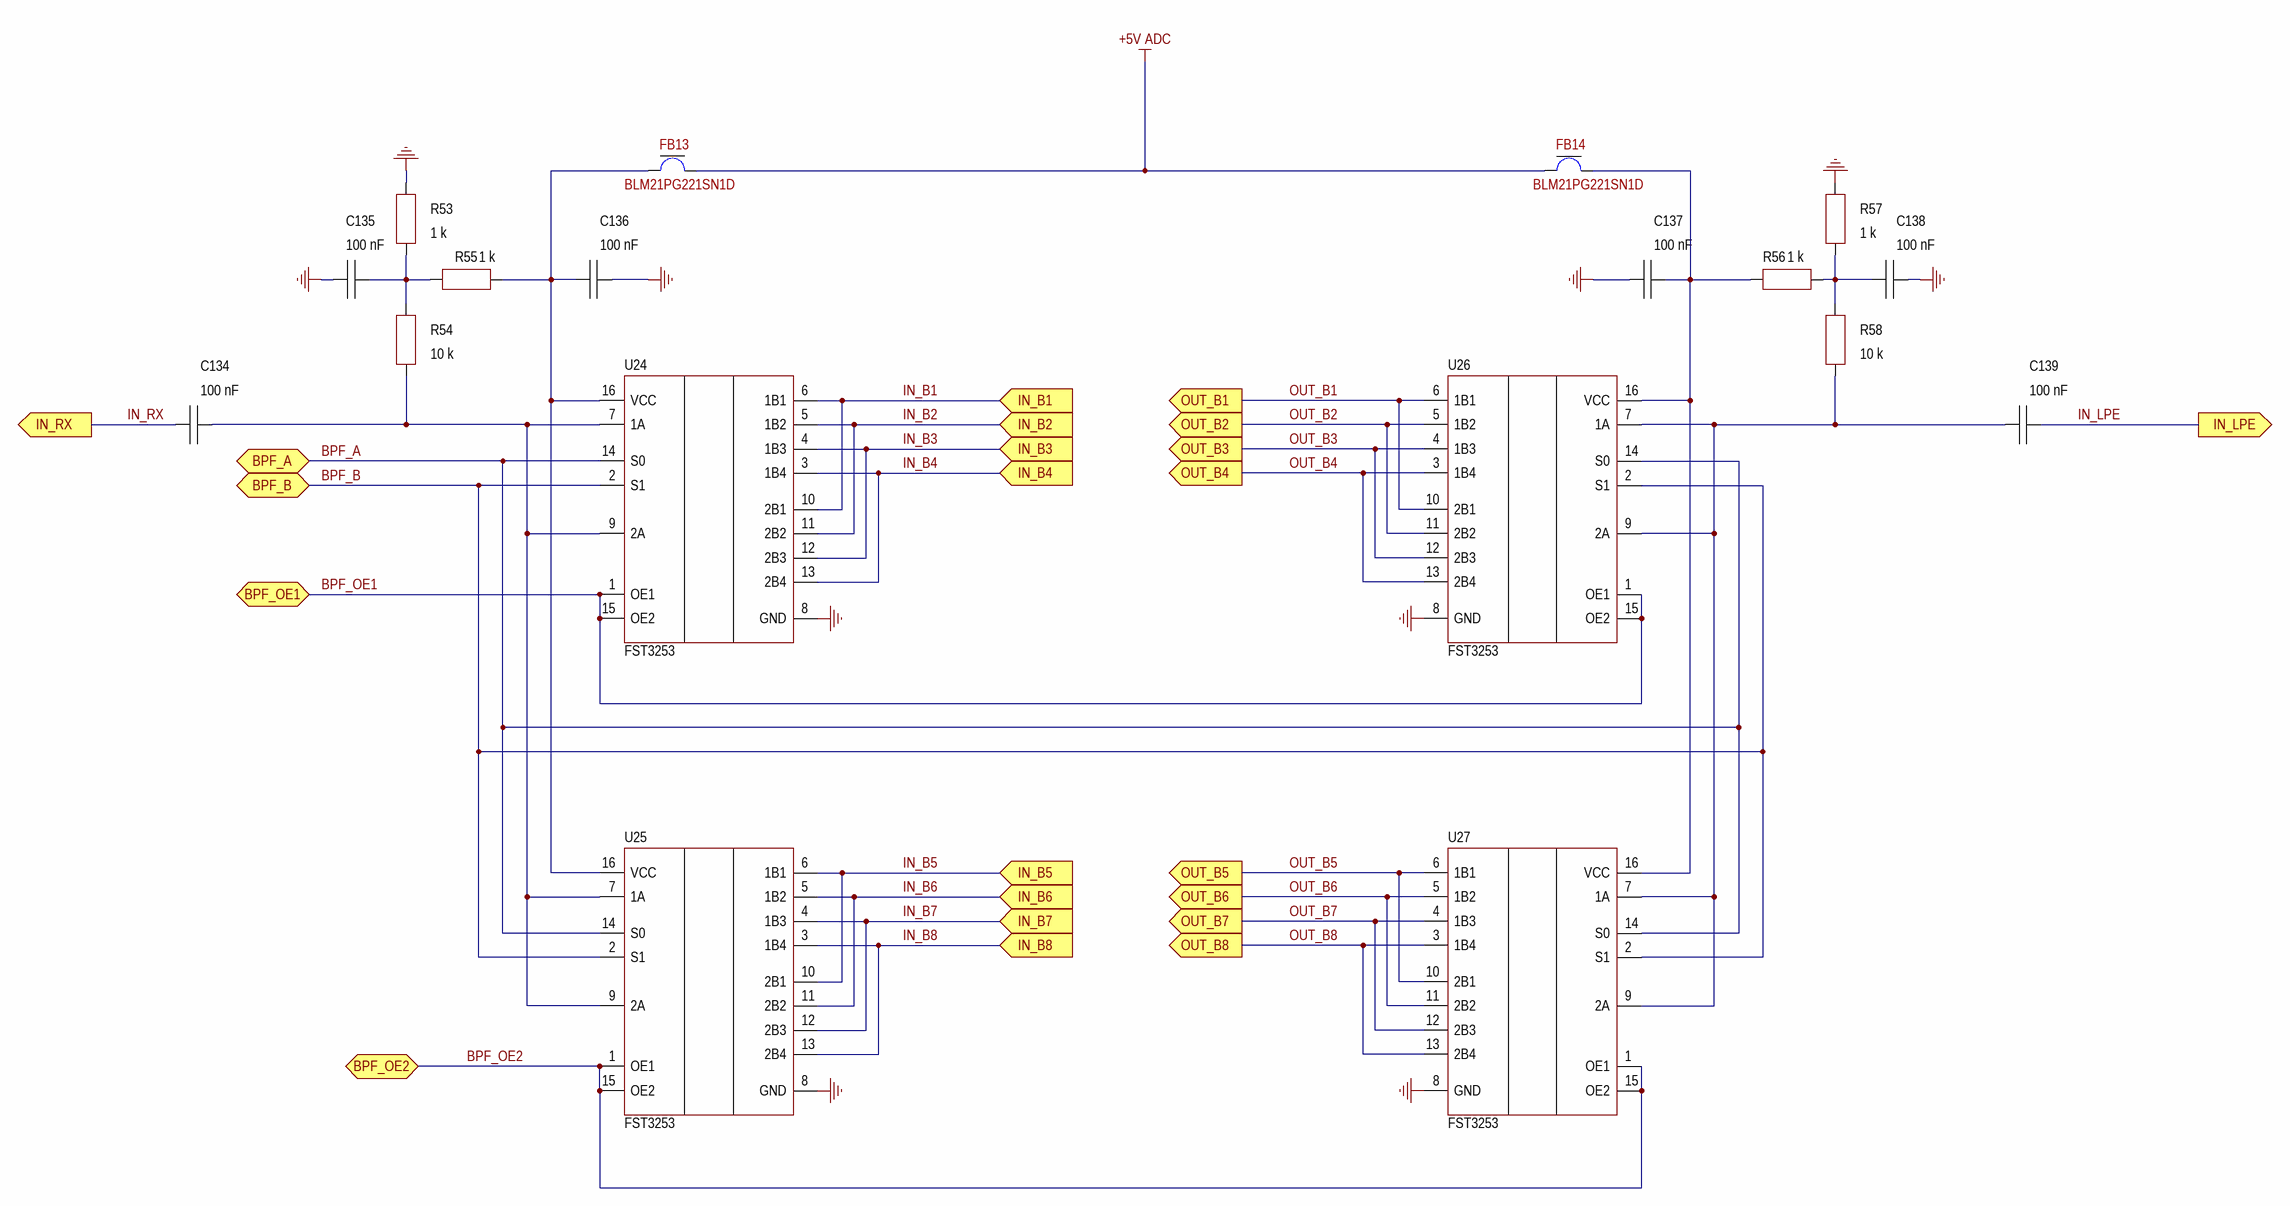
[diagram p9: WL-BPF.SchDoc]

### Parts
C134  100 nF  [C-0805-0.95]
C135  100 nF  [C-0805-0.95]
C136  100 nF  [C-0805-0.95]
C137  100 nF  [C-0805-0.95]
C138  100 nF  [C-0805-0.95]
C139  100 nF  [C-0805-0.95]
FB13  BLM21PG221SN1D  [L-0805]
FB14  BLM21PG221SN1D  [L-0805]
R53  1 k  [R-0805]
R54  10 k  [R-0805]
R55  1 k  [R-0805]
R56  1 k  [R-0805]
R57  1 k  [R-0805]
R58  10 k  [R-0805]
U24  FST3253  [SSOP-16]
U25  FST3253  [SSOP-16]
U26  FST3253  [SSOP-16]
U27  FST3253  [SSOP-16]

### Ports
BPF_A (bidir), BPF_B (bidir), BPF_OE1 (bidir), BPF_OE2 (bidir), IN_B1 (in), IN_B2 (in), IN_B3 (in), IN_B4 (in), IN_B5 (in), IN_B6 (in), IN_B7 (in), IN_B8 (in), IN_LPE (out), IN_RX (out), OUT_B1 (out), OUT_B2 (out), OUT_B3 (out), OUT_B4 (out), OUT_B5 (out), OUT_B6 (out), OUT_B7 (out), OUT_B8 (out)

### Nets
+5V ADC: FB13.2 FB14.2
GND: C135.1 C136.2 C137.2 C138.1 R53.1 R57.1 U24.8(GND) U25.8(GND) U26.8(GND) U27.8(GND)
BPF_A: U24.14(S0) U25.14(S0) U26.14(S0) U27.14(S0) ; port BPF_A
BPF_B: U24.2(S1) U25.2(S1) U26.2(S1) U27.2(S1) ; port BPF_B
BPF_OE1: U24.1(OE1) U24.15(OE2) U26.1(OE1) U26.15(OE2) ; port BPF_OE1
BPF_OE2: U25.1(OE1) U25.15(OE2) U27.1(OE1) U27.15(OE2) ; port BPF_OE2
IN_B1: U24.6(1B1) U24.10(2B1) ; port IN_B1
IN_B2: U24.5(1B2) U24.11(2B2) ; port IN_B2
IN_B3: U24.4(1B3) U24.12(2B3) ; port IN_B3
IN_B4: U24.3(1B4) U24.13(2B4) ; port IN_B4
IN_B5: U25.6(1B1) U25.10(2B1) ; port IN_B5
IN_B6: U25.5(1B2) U25.11(2B2) ; port IN_B6
IN_B7: U25.4(1B3) U25.12(2B3) ; port IN_B7
IN_B8: U25.3(1B4) U25.13(2B4) U27.3(1B4) U27.13(2B4) ; port IN_B8, port OUT_B8  [also labelled OUT_B8]
IN_LPE: C139.1 ; port IN_LPE
IN_RX: C134.1 ; port IN_RX
OUT_B1: U26.6(1B1) U26.10(2B1) ; port OUT_B1
OUT_B2: U26.5(1B2) U26.11(2B2) ; port OUT_B2
OUT_B3: U26.4(1B3) U26.12(2B3) ; port OUT_B3
OUT_B4: U26.3(1B4) U26.13(2B4) ; port OUT_B4
OUT_B5: U27.6(1B1) U27.10(2B1) ; port OUT_B5
OUT_B6: U27.5(1B2) U27.11(2B2) ; port OUT_B6
OUT_B7: U27.4(1B3) U27.12(2B3) ; port OUT_B7
NetC134_2: C134.2 R54.1 U24.7(1A) U24.9(2A) U25.7(1A) U25.9(2A)
NetC135_2: C135.2 R53.2 R54.2 R55.2
NetC136_1: C136.1 FB13.1 R55.1 U24.16(VCC) U25.16(VCC)
NetC137_1: C137.1 FB14.1 R56.1 U26.16(VCC) U27.16(VCC)
NetC138_2: C138.2 R56.2 R57.2 R58.2
NetC139_2: C139.2 R58.1 U26.7(1A) U26.9(2A) U27.7(1A) U27.9(2A)

### Notes on the sheet
- Подп. дата
- Инв. № дубл.
- Взам. инв. №
- Подп. и дата
- Инв. № подл.
- Изм.
- Лист
- № докум.
- Подп.
- Дата
- ALTIUM GOSTBOM2.0 KEV
- Файл:
- Копировал
- Формат А2

### Library data of the parts
C134-C139 = CC0805KRX7R9BB104: Manufacturer: Yageo; Value: 100; Type: Конденсатор; Dielectric: X7R; Tolerance: ±10%; Voltage: 50 V; CommentDOC: ( CC - 0805 - X7R - 50 V - 100 nF ±10% ); Part Number: CC0805KRX7R9BB104; Units: nF; Case: 0805; Operating Temperature: -55 ... 125 °C; Series: CC; Value+Units: 100 nF; ValueSCH: 100 nF; ( Series - Case - Dielectric -  Voltage - Value+Units Tolerance: ( CC - 0805 - X7R - 50 V - 100 nF ±10% )
FB13 FB14 = BLM21PG221SN1D: Manufacturer: Murata Electronics; Type: Ферритовая бусина; Part Number: BLM21PG221SN1D; Series: EMIFIL; Case: 0805; ValueSCH: BLM21PG221SN1D; Operating Temperature: −55°C ... 125°C
R53 R55-R57 = RC0805JR-071KL: Manufacturer: Yageo; Value: 1; Power: 0,125 W; Units: kOhm; Tolerance: ±5%; Operating Voltage: 150 V; Value+Units: 1 kOhm; CommentDOC: ( RC - 0805 - 0,125 W - 1 kOhm  ±5% ); Type: Резистор; Part Number: RC0805JR-071KL; Case: 0805; Operating Temperature: -55°C ... 155°C; ValueSCH: 1 k; Series: RC
R54 R58 = RC0805JR-0710KL: Manufacturer: Yageo; Value: 10; Power: 0,125 W; Units: kOhm; Tolerance: ±5%; Operating Voltage: 150 V; Value+Units: 10 kOhm; CommentDOC: ( RC - 0805 - 0,125 W - 10 kOhm  ±5% ); Type: Резистор; Part Number: RC0805JR-0710KL; Case: 0805; Operating Temperature: -55°C ... 155°C; ValueSCH: 10 k; Series: RC
U24-U27 = 74FST3253QSR: IC MUX/DEMUX 2 X 4:1; Manufacturer: ON Semiconductor; Voltage  Supply: +4 V … 5,5 V; Part Number: 74FST3253QSR; Function: IC MUX/DEMUX 2 X 4:1; Case: SSOP-16; Operating Temperature: -40 ... 85 °C; Type: Микросхема

## Sheet WL-CONNECT.SchDoc
size 420 x 297 mm; Scale: 1:1; DocumentType: Схема электрическая принципиальная; FirstReferrence: АБВГ.123456.001; DocumentNumber: 12; SheetNumber: 9; SheetTotal: 12
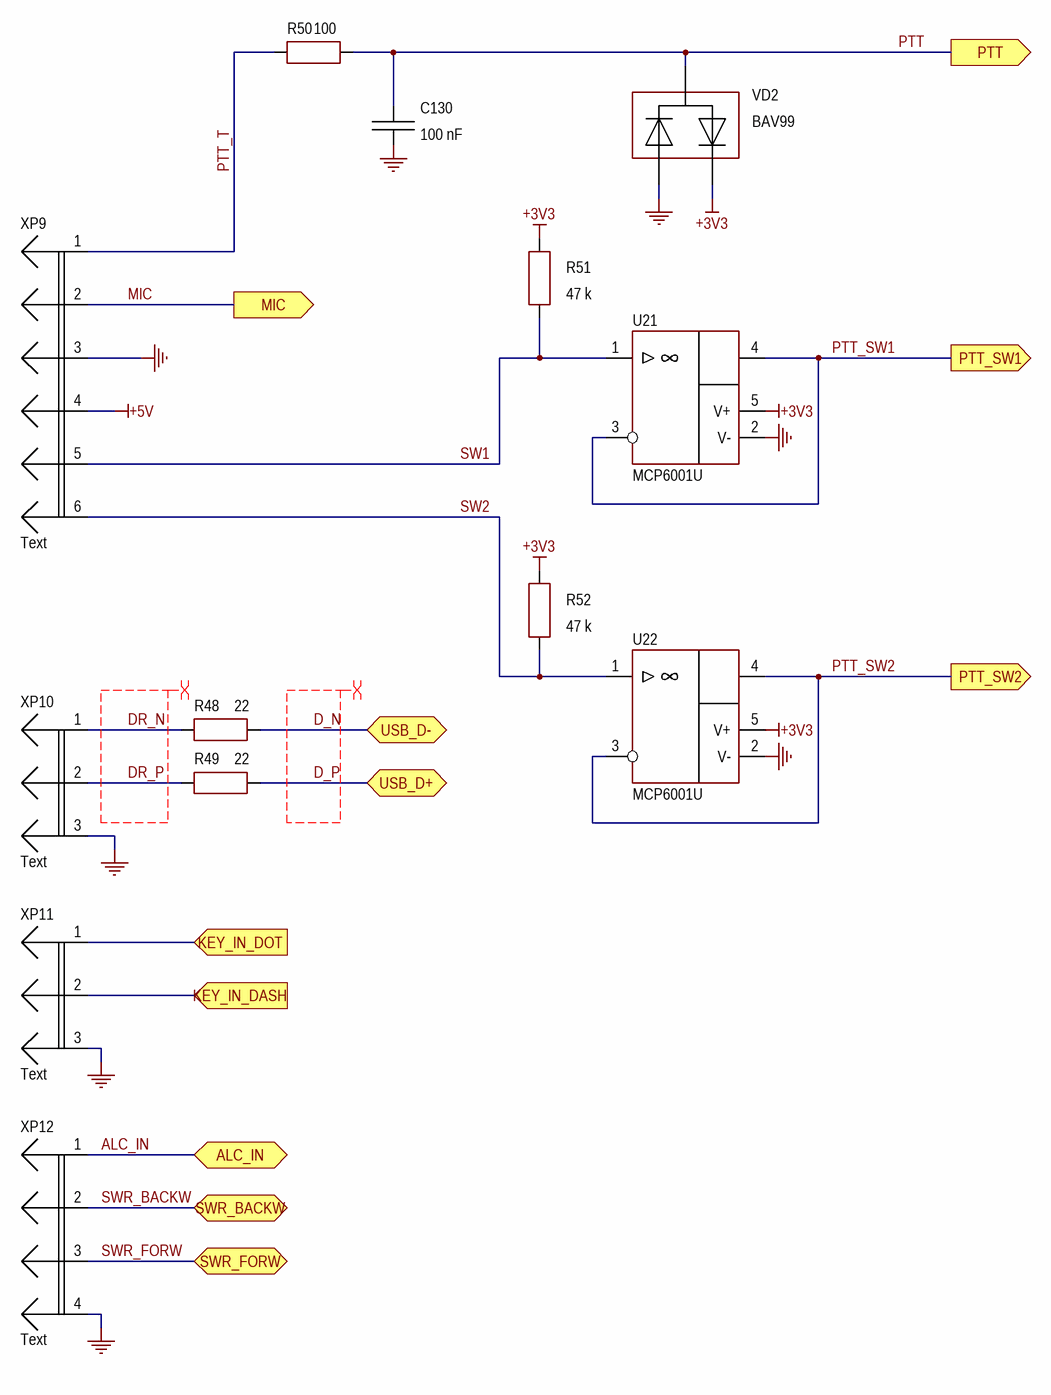
[diagram p10: WL-CONNECT.SchDoc]

### Parts
C130  100 nF  [C-0805-0.95]
R48  22  [R-0805]
R49  22  [R-0805]
R50  100  [R-0805]
R51  47 k  [R-0805]
R52  47 k  [R-0805]
U21  MCP6001U  [SOT-23-5]
U22  MCP6001U  [SOT-23-5]
VD2  BAV99  [SOT-23]
XP9  Text  [61900611121]
XP10  Text  [61900311121]
XP11  Text  [61900311121]
XP12  Text  [61900411121]

### Ports
ALC_IN (bidir), KEY_IN_DASH (in), KEY_IN_DOT (in), MIC (out), PTT (out), PTT_SW1 (out), PTT_SW2 (out), SWR_BACKW (bidir), SWR_FORW (bidir), USB_D+ (bidir), USB_D- (bidir)

### Nets
+3V3: R51.2 R52.2 U21.5(V+) U22.5(V+) VD2.2
+5V: XP9.4
GND: C130.1 U21.2(V-) U22.2(V-) VD2.1 XP9.3 XP10.3 XP11.3 XP12.4
ALC_IN: XP12.1 ; port ALC_IN
D_N: R48.2 ; port USB_D-
D_P: R49.2 ; port USB_D+
DR_N: R48.1 XP10.1
DR_P: R49.1 XP10.2
KEY_IN_DASH: XP11.2 ; port KEY_IN_DASH
KEY_IN_DOT: XP11.1 ; port KEY_IN_DOT
MIC: XP9.2 ; port MIC
PTT: C130.2 R50.2 VD2.3 ; port PTT
PTT_SW1: U21.3(-IN) U21.4(OUT) ; port PTT_SW1
PTT_SW2: U22.3(-IN) U22.4(OUT) ; port PTT_SW2
PTT_T: R50.1 XP9.1
SW1: R51.1 U21.1(+IN) XP9.5
SW2: R52.1 U22.1(+IN) XP9.6
SWR_BACKW: XP12.2 ; port SWR_BACKW
SWR_FORW: XP12.3 ; port SWR_FORW

### Layout directives
differential pair: D_N, D_P, DR_N, DR_P

### Notes on the sheet
- Подп. дата
- Инв. № дубл.
- Взам. инв. №
- Подп. и дата
- Инв. № подл.
- Изм.
- Лист
- № докум.
- Подп.
- Дата
- ALTIUM GOSTBOM2.0 KEV
- Файл:
- Копировал
- Формат А3

### Library data of the parts
C130 = CC0805KRX7R9BB104: as C134-C139 on sheet WL-BPF; Part Number: CC0805KRX7R9BB104; Units: nF; Case: 0805; Operating Temperature: -55 ... 125 °C; Series: CC; Value+Units: 100 nF; ValueSCH: 100 nF; ( Series - Case - Dielectric -  Voltage - Value+Units Tolerance: ( CC - 0805 - X7R - 50 V - 100 nF ±10% )
R48 R49 = RC0805JR-0722RL: Manufacturer: Yageo; Power: 0,125 W; Units: Ohm; Tolerance: ±5%; Operating Voltage: 150 V; Value+Units: 22 Ohm; CommentDOC: ( RC - 0805 - 0,125 W - 22 Ohm  ±5% ); Value: 22; Type: Резистор; Part Number: RC0805JR-0722RL; Case: 0805; Operating Temperature: -55°C ... 155°C; ValueSCH: 22; Series: RC
R50 = RC0805JR-07100RL: Manufacturer: Yageo; Power: 0,125 W; Units: Ohm; Tolerance: ±5%; Operating Voltage: 150 V; Value+Units: 100 Ohm; CommentDOC: ( RC - 0805 - 0,125 W - 100 Ohm  ±5% ); Value: 100; Type: Резистор; Part Number: RC0805JR-07100RL; Case: 0805; Operating Temperature: -55°C ... 155°C; ValueSCH: 100; Series: RC
R51 R52 = RC0805JR-0747KL: Manufacturer: Yageo; Value: 47; Power: 0,125 W; Units: kOhm; Tolerance: ±5%; Operating Voltage: 150 V; Value+Units: 47 kOhm; CommentDOC: ( RC - 0805 - 0,125 W - 47 kOhm  ±5% ); Type: Резистор; Part Number: RC0805JR-0747KL; Case: 0805; Operating Temperature: -55°C ... 155°C; ValueSCH: 47 k; Series: RC
U21 U22 = MCP6001UT-I/OT: IC OPAMP GP 1 CIRCUIT SOT-23-5; Manufacturer: Microchip Technology; Bandwidth: 1 MHz; Voltage  Supply: +1,8 V...±6 V; Type: Микросхема; Part Number: MCP6001UT-I/OT; Case: SOT-23-5; Operating Temperature: −40°C … 85°C
VD2 = BAV99,215: Manufacturer: Nexperia USA Inc.; Type: Диод; Voltage Revers: 100 V; Current: 215 mA; Part Number: BAV99,215; ValueSCH: BAV99; Case: SOT-23; Operating Temperature: -65°С ... 150°С
XP9 = 61900611121: Manufacturer: Würth Elektronik; Pitch: 2,54 mm; Functional Analog: WF-6; Type: Вилка; Part Number: 61900611121; Series: WE-WTB; Number of Pins: 6; Operating Temperature: −40°C ... 105°C
XP10 XP11 = 61900311121: Manufacturer: Würth Elektronik; Pitch: 2,54 mm; Functional Analog: WF-3; Type: Вилка; Part Number: 61900311121; Series: WE-WTB; Number of Pins: 3; Operating Temperature: −40°C ... 105°C
XP12 = 61900411121: Manufacturer: Würth Elektronik; Pitch: 2,54 mm; Functional Analog: WF-4; Type: Вилка; Part Number: 61900411121; Series: WE-WTB; Number of Pins: 4; Operating Temperature: −40°C ... 105°C

## Sheet WL-BPF_L.SchDoc
size 420 x 297 mm; Scale: 1:1; DocumentType: Схема электрическая принципиальная; FirstReferrence: АБВГ.123456.001; DocumentNumber: 11; SheetNumber: 12; SheetTotal: 12
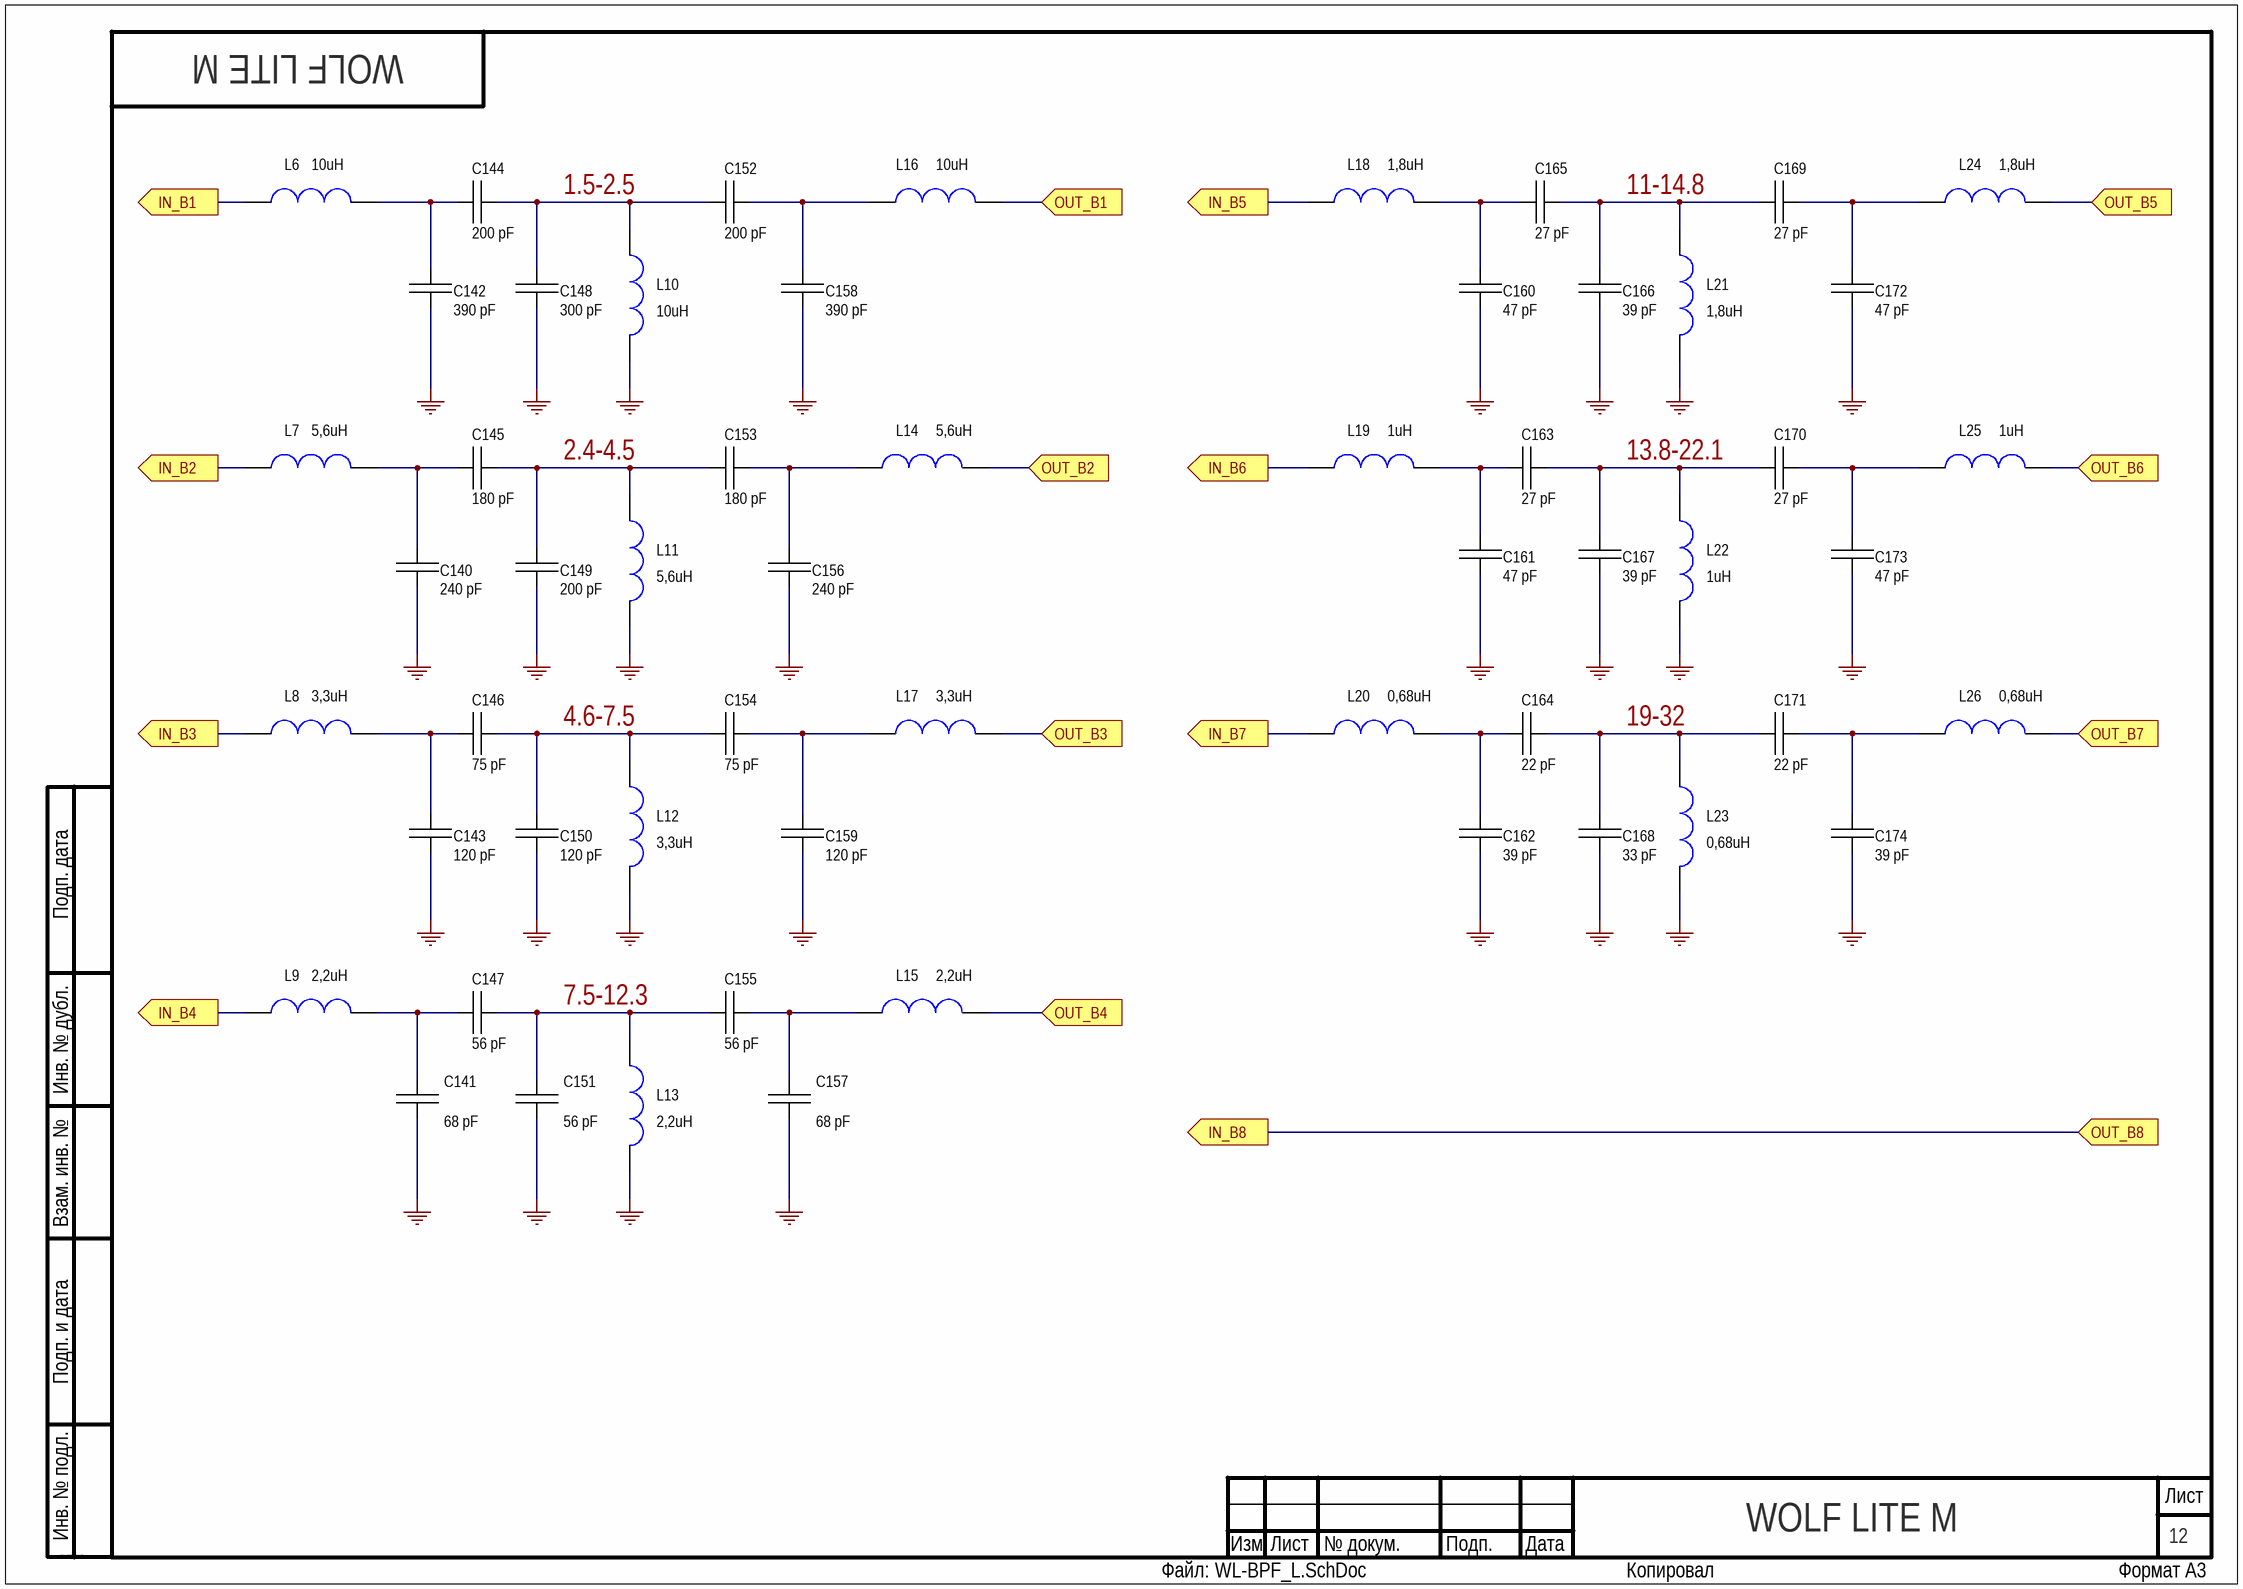
[diagram p11: WL-BPF_L.SchDoc]

### Parts
C140  240 pF  [C-0805-0.7]
C141  68 pF  [C-0805-0.7]
C142  390 pF  [C-0805-0.7]
C143  120 pF  [C-0805-0.7]
C144  200 pF  [C-0805-0.7]
C145  180 pF  [C-0805-0.7]
C146  75 pF  [C-0805-0.7]
C147  56 pF  [C-0805-0.7]
C148  300 pF  [C-0805-0.7]
C149  200 pF  [C-0805-0.7]
C150  120 pF  [C-0805-0.7]
C151  56 pF  [C-0805-0.7]
C152  200 pF  [C-0805-0.7]
C153  180 pF  [C-0805-0.7]
C154  75 pF  [C-0805-0.7]
C155  56 pF  [C-0805-0.7]
C156  240 pF  [C-0805-0.7]
C157  68 pF  [C-0805-0.7]
C158  390 pF  [C-0805-0.7]
C159  120 pF  [C-0805-0.7]
C160  47 pF  [C-0805-0.7]
C161  47 pF  [C-0805-0.7]
C162  39 pF  [C-0805-0.7]
C163  27 pF  [C-0805-0.7]
C164  22 pF  [C-0805-0.7]
C165  27 pF  [C-0805-0.7]
C166  39 pF  [C-0805-0.7]
C167  39 pF  [C-0805-0.7]
C168  33 pF  [C-0805-0.7]
C169  27 pF  [C-0805-0.7]
C170  27 pF  [C-0805-0.7]
C171  22 pF  [C-0805-0.7]
C172  47 pF  [C-0805-0.7]
C173  47 pF  [C-0805-0.7]
C174  39 pF  [C-0805-0.7]
L6  10uH  [L-1210]
L7  5,6uH  [L-1210]
L8  3,3uH  [L-1210]
L9  2,2uH  [L-1210]
L10  10uH  [L-1210]
L11  5,6uH  [L-1210]
L12  3,3uH  [L-1210]
L13  2,2uH  [L-1210]
L14  5,6uH  [L-1210]
L15  2,2uH  [L-1210]
L16  10uH  [L-1210]
L17  3,3uH  [L-1210]
L18  1,8uH  [L-1210]
L19  1uH  [L-1210]
L20  0,68uH  [L-1210]
L21  1,8uH  [L-1210]
L22  1uH  [L-1210]
L23  0,68uH  [L-1210]
L24  1,8uH  [L-1210]
L25  1uH  [L-1210]
L26  0,68uH  [L-1210]

### Ports
IN_B1 (out), IN_B2 (out), IN_B3 (out), IN_B4 (out), IN_B5 (out), IN_B6 (out), IN_B7 (out), IN_B8 (out), OUT_B1 (in), OUT_B2 (in), OUT_B3 (in), OUT_B4 (in), OUT_B5 (in), OUT_B6 (in), OUT_B7 (in), OUT_B8 (in)

### Nets
GND: C140.1 C141.1 C142.1 C143.1 C148.1 C149.1 C150.1 C151.1 C156.1 C157.1 C158.1 C159.1 C160.1 C161.1 C162.1 C166.1 C167.1 C168.1 C172.1 C173.1 C174.1 L10.2 L11.2 L12.2 L13.2 L21.2 L22.2 L23.2
IN_B1: L6.1 ; port IN_B1
IN_B2: L7.1 ; port IN_B2
IN_B3: L8.1 ; port IN_B3
IN_B4: L9.1 ; port IN_B4
IN_B5: L18.1 ; port IN_B5
IN_B6: L19.1 ; port IN_B6
IN_B7: L20.1 ; port IN_B7
IN_B8: port IN_B8, port OUT_B8
OUT_B1: L16.2 ; port OUT_B1
OUT_B2: L14.2 ; port OUT_B2
OUT_B3: L17.2 ; port OUT_B3
OUT_B4: L15.2 ; port OUT_B4
OUT_B5: L24.2 ; port OUT_B5
OUT_B6: L25.2 ; port OUT_B6
OUT_B7: L26.2 ; port OUT_B7
NetC140_2: C140.2 C145.1 L7.2
NetC141_2: C141.2 C147.2 L9.2
NetC142_2: C142.2 C144.1 L6.2
NetC143_2: C143.2 C146.1 L8.2
NetC144_2: C144.2 C148.2 C152.1 L10.1
NetC145_2: C145.2 C149.2 C153.1 L11.1
NetC146_2: C146.2 C150.2 C154.1 L12.1
NetC147_1: C147.1 C151.2 C155.2 L13.1
NetC152_2: C152.2 C158.2 L16.1
NetC153_2: C153.2 C156.2 L14.1
NetC154_2: C154.2 C159.2 L17.1
NetC155_1: C155.1 C157.2 L15.1
NetC160_2: C160.2 C165.1 L18.2
NetC161_2: C161.2 C163.1 L19.2
NetC162_2: C162.2 C164.1 L20.2
NetC163_2: C163.2 C167.2 C170.1 L22.1
NetC164_2: C164.2 C168.2 C171.1 L23.1
NetC165_2: C165.2 C166.2 C169.1 L21.1
NetC169_2: C169.2 C172.2 L24.1
NetC170_2: C170.2 C173.2 L25.1
NetC171_2: C171.2 C174.2 L26.1

### Notes on the sheet
- 1.5-2.5
- 11-14.8
- 2.4-4.5
- (near C170) 13.8-22.1
- 4.6-7.5
- 19-32
- 7.5-12.3
- Подп. дата
- Инв. № дубл.
- Взам. инв. №
- Подп. и дата
- Инв. № подл.
- Изм.
- Лист
- № докум.
- Подп.
- Дата
- ALTIUM GOSTBOM2.0 KEV
- Файл:
- Копировал
- Формат А3

### Library data of the parts
C140 C156 = CC0805JRNPO9BN241: Manufacturer: Yageo; Type: Конденсатор; Dielectric: NPO; Value: 240; Tolerance: ±5%; Voltage: 50 V; CommentDOC: ( CC - 0805 - NPO - 50 V - 240 pF ±5% ); Part Number: CC0805JRNPO9BN241; Units: pF; Case: 0805; Operating Temperature: -55 ... 125 °C; Series: CC; Value+Units: 240 pF; ValueSCH: 240 pF; ( Series - Case - Dielectric -  Voltage - Value+Units Tolerance: ( CC - 0805 - NPO - 50 V - 240 pF ±5% )
C141 C157 = CC0805JRNPO9BN680: Manufacturer: Yageo; Type: Конденсатор; Dielectric: NPO; Value: 68; Tolerance: ±5%; Voltage: 50 V; CommentDOC: ( CC - 0805 - NPO - 50 V - 68 pF ±5% ); Part Number: CC0805JRNPO9BN680; Units: pF; Case: 0805; Operating Temperature: -55 ... 125 °C; Series: CC; Value+Units: 68 pF; ValueSCH: 68 pF; ( Series - Case - Dielectric -  Voltage - Value+Units Tolerance: ( CC - 0805 - NPO - 50 V - 68 pF ±5% )
C142 C158 = CC0805JRNPO9BN391: Manufacturer: Yageo; Type: Конденсатор; Dielectric: NPO; Value: 390; Tolerance: ±5%; Voltage: 50 V; CommentDOC: ( CC - 0805 - NPO - 50 V - 390 pF ±5% ); Part Number: CC0805JRNPO9BN391; Units: pF; Case: 0805; Operating Temperature: -55 ... 125 °C; Series: CC; Value+Units: 390 pF; ValueSCH: 390 pF; ( Series - Case - Dielectric -  Voltage - Value+Units Tolerance: ( CC - 0805 - NPO - 50 V - 390 pF ±5% )
C143 C150 C159 = CC0805JRNPO9BN121: Manufacturer: Yageo; Type: Конденсатор; Dielectric: NPO; Value: 120; Tolerance: ±5%; Voltage: 50 V; CommentDOC: ( CC - 0805 - NPO - 50 V - 120 pF ±5% ); Part Number: CC0805JRNPO9BN121; Units: pF; Case: 0805; Operating Temperature: -55 ... 125 °C; Series: CC; Value+Units: 120 pF; ValueSCH: 120 pF; ( Series - Case - Dielectric -  Voltage - Value+Units Tolerance: ( CC - 0805 - NPO - 50 V - 120 pF ±5% )
C144 C149 C152 = CC0805JRNPO9BN201: Manufacturer: Yageo; Type: Конденсатор; Dielectric: NPO; Value: 200; Tolerance: ±5%; Voltage: 50 V; CommentDOC: ( CC - 0805 - NPO - 50 V - 200 pF ±5% ); Part Number: CC0805JRNPO9BN201; Units: pF; Case: 0805; Operating Temperature: -55 ... 125 °C; Series: CC; Value+Units: 200 pF; ValueSCH: 200 pF; ( Series - Case - Dielectric -  Voltage - Value+Units Tolerance: ( CC - 0805 - NPO - 50 V - 200 pF ±5% )
C145 C153 = CC0805JRNPO9BN181: Manufacturer: Yageo; Type: Конденсатор; Dielectric: NPO; Value: 180; Tolerance: ±5%; Voltage: 50 V; CommentDOC: ( CC - 0805 - NPO - 50 V - 180 pF ±5% ); Part Number: CC0805JRNPO9BN181; Units: pF; Case: 0805; Operating Temperature: -55 ... 125 °C; Series: CC; Value+Units: 180 pF; ValueSCH: 180 pF; ( Series - Case - Dielectric -  Voltage - Value+Units Tolerance: ( CC - 0805 - NPO - 50 V - 180 pF ±5% )
C146 C154 = CC0805JRNPO9BN750: Manufacturer: Yageo; Type: Конденсатор; Dielectric: NPO; Value: 75; Tolerance: ±5%; Voltage: 50 V; CommentDOC: ( CC - 0805 - NPO - 50 V - 75 pF ±5% ); Part Number: CC0805JRNPO9BN750; Units: pF; Case: 0805; Operating Temperature: -55 ... 125 °C; Series: CC; Value+Units: 75 pF; ValueSCH: 75 pF; ( Series - Case - Dielectric -  Voltage - Value+Units Tolerance: ( CC - 0805 - NPO - 50 V - 75 pF ±5% )
C147 C151 C155 = CC0805JRNPO9BN560: Manufacturer: Yageo; Type: Конденсатор; Dielectric: NPO; Value: 56; Tolerance: ±5%; Voltage: 50 V; CommentDOC: ( CC - 0805 - NPO - 50 V - 56 pF ±5% ); Part Number: CC0805JRNPO9BN560; Units: pF; Case: 0805; Operating Temperature: -55 ... 125 °C; Series: CC; Value+Units: 56 pF; ValueSCH: 56 pF; ( Series - Case - Dielectric -  Voltage - Value+Units Tolerance: ( CC - 0805 - NPO - 50 V - 56 pF ±5% )
C148 = CC0805JRNPO9BN301: Manufacturer: Yageo; Type: Конденсатор; Dielectric: NPO; Value: 300; Tolerance: ±5%; Voltage: 50 V; CommentDOC: ( CC - 0805 - NPO - 50 V - 300 pF ±5% ); Part Number: CC0805JRNPO9BN301; Units: pF; Case: 0805; Operating Temperature: -55 ... 125 °C; Series: CC; Value+Units: 300 pF; ValueSCH: 300 pF; ( Series - Case - Dielectric -  Voltage - Value+Units Tolerance: ( CC - 0805 - NPO - 50 V - 300 pF ±5% )
C160 C161 C172 C173 = CC0805JRNPO9BN470: Manufacturer: Yageo; Type: Конденсатор; Dielectric: NPO; Value: 47; Tolerance: ±5%; Voltage: 50 V; CommentDOC: ( CC - 0805 - NPO - 50 V - 47 pF ±5% ); Part Number: CC0805JRNPO9BN470; Units: pF; Case: 0805; Operating Temperature: -55 ... 125 °C; Series: CC; Value+Units: 47 pF; ValueSCH: 47 pF; ( Series - Case - Dielectric -  Voltage - Value+Units Tolerance: ( CC - 0805 - NPO - 50 V - 47 pF ±5% )
C162 C166 C167 C174 = CC0805JRNPO9BN390: Manufacturer: Yageo; Type: Конденсатор; Dielectric: NPO; Value: 39; Tolerance: ±5%; Voltage: 50 V; CommentDOC: ( CC - 0805 - NPO - 50 V - 39 pF ±5% ); Part Number: CC0805JRNPO9BN390; Units: pF; Case: 0805; Operating Temperature: -55 ... 125 °C; Series: CC; Value+Units: 39 pF; ValueSCH: 39 pF; ( Series - Case - Dielectric -  Voltage - Value+Units Tolerance: ( CC - 0805 - NPO - 50 V - 39 pF ±5% )
C163 C165 C169 C170 = CC0805JRNPO9BN270: Manufacturer: Yageo; Type: Конденсатор; Dielectric: NPO; Value: 27; Tolerance: ±5%; Voltage: 50 V; CommentDOC: ( CC - 0805 - NPO - 50 V - 27 pF ±5% ); Part Number: CC0805JRNPO9BN270; Units: pF; Case: 0805; Operating Temperature: -55 ... 125 °C; Series: CC; Value+Units: 27 pF; ValueSCH: 27 pF; ( Series - Case - Dielectric -  Voltage - Value+Units Tolerance: ( CC - 0805 - NPO - 50 V - 27 pF ±5% )
C164 C171 = CC0805JRNPO9BN220: Manufacturer: Yageo; Type: Конденсатор; Dielectric: NPO; Value: 22; Tolerance: ±5%; Voltage: 50 V; CommentDOC: ( CC - 0805 - NPO - 50 V - 22 pF ±5% ); Part Number: CC0805JRNPO9BN220; Units: pF; Case: 0805; Operating Temperature: -55 ... 125 °C; Series: CC; Value+Units: 22 pF; ValueSCH: 22 pF; ( Series - Case - Dielectric -  Voltage - Value+Units Tolerance: ( CC - 0805 - NPO - 50 V - 22 pF ±5% )
C168 = CC0805JRNPO9BN330: Manufacturer: Yageo; Type: Конденсатор; Dielectric: NPO; Value: 33; Tolerance: ±5%; Voltage: 50 V; CommentDOC: ( CC - 0805 - NPO - 50 V - 33 pF ±5% ); Part Number: CC0805JRNPO9BN330; Units: pF; Case: 0805; Operating Temperature: -55 ... 125 °C; Series: CC; Value+Units: 33 pF; ValueSCH: 33 pF; ( Series - Case - Dielectric -  Voltage - Value+Units Tolerance: ( CC - 0805 - NPO - 50 V - 33 pF ±5% )
L6 L10 L16 = FHW1210IF100JST: Manufacturer: FH(Guangdong Fenghua Advanced Tech); Type: Дроссель; Part Number: FHW1210IF100JST; Series: FHW; Case: 1210; ValueSCH: 10uH
L7 L11 L14 = FHW1210IF5R6JST: Manufacturer: FH(Guangdong Fenghua Advanced Tech); Type: Дроссель; Part Number: FHW1210IF5R6JST; Series: FHW; Case: 1210; ValueSCH: 5,6uH
L8 L12 L17 = FHW1210IF3R3JST: Manufacturer: FH(Guangdong Fenghua Advanced Tech); Type: Дроссель; Part Number: FHW1210IF3R3JST; Series: FHW; Case: 1210; ValueSCH: 3,3uH
L9 L13 L15 = FHW1210IF2R2JST: Manufacturer: FH(Guangdong Fenghua Advanced Tech); Type: Дроссель; Part Number: FHW1210IF2R2JST; Series: FHW; Case: 1210; ValueSCH: 2,2uH
L18 L21 L24 = FHW1210IF1R8JST: Manufacturer: FH(Guangdong Fenghua Advanced Tech); Type: Дроссель; Part Number: FHW1210IF1R8JST; Series: FHW; Case: 1210; ValueSCH: 1,8uH
L19 L22 L25 = FHW1210IF1R0KST: Manufacturer: FH(Guangdong Fenghua Advanced Tech); Type: Дроссель; Part Number: FHW1210IF1R0KST; Series: FHW; Case: 1210; ValueSCH: 1uH
L20 L23 L26 = FHW1210HCR68JGT: Manufacturer: FH(Guangdong Fenghua Advanced Tech); Type: Дроссель; Part Number: FHW1210HCR68JGT; Series: FHW; Case: 1210; ValueSCH: 0,68uH

## Nets that join several sheets
+1.2V: WL-POWER (10 pins), WL-FPGA (12 pins)
+2.5V: WL-POWER (8 pins), WL-FPGA (U4.35 U4.96 U4.107)
+3V3: WL-POWER (21 pins), WL-FPGA (19 pins), WL-CPU (14 pins), WL-AUDIO (FB9.2 FB10.2 R29.1 R30.1), WL-CONNECT (5 pins)
+3V3 ADC: WL-POWER (C99.1 C102.2 U16.2), WL-ADC (FB2.1 FB4.2 FB5.1), WL-ATT (FB12.2)
+3V3 DAC: WL-POWER (C100.1 C103.2 U17.2), WL-DAC (FB6.2)
+5V: WL-POWER (C118.1 U19.5), WL-CONNECT (XP9.4)
+5V ADC: WL-POWER (C85.1 C90.2 U12.2 U16.3), WL-ADC (FB3.1), WL-BPF (FB13.2 FB14.2)
+5V DAC: WL-POWER (C86.1 C91.2 U13.2 U17.3), WL-DAC (FB7.2), WL-CONTROL (C77.1 U11.6 U11.16)
+8Power: WL-POWER (14 pins), WL-DAC (FB8.2), WL-AUDIO (C73.1 C74.1 U10.6)
+Power: WL-POWER (U20.3 VT5.3), WL-CPU (R1.2), WL-CONTROL (R45.2 VT3.2)
GND: WL-POWER (64 pins), WL-ADC (34 pins), WL-FPGA (26 pins), WL-DAC (25 pins), WL-ATT (12 pins), WL-CPU (20 pins), WL-AUDIO (28 pins), WL-CONTROL (9 pins), WL-BPF (10 pins), WL-CONNECT (8 pins), WL-BPF_L (28 pins)
ALC_IN: WL-CPU (U1.34), WL-CONNECT (XP12.1)
ATT_ON_0.5: WL-FPGA (U4.86), WL-ATT (U23.20)
ATT_ON_1: WL-FPGA (U4.87), WL-ATT (U23.19)
ATT_ON_2: WL-FPGA (U4.98), WL-ATT (U23.17)
ATT_ON_4: WL-FPGA (U4.99), WL-ATT (U23.16)
ATT_ON_8: WL-FPGA (U4.100), WL-ATT (U23.15)
ATT_ON_16: WL-FPGA (U4.85), WL-ATT (U23.1)
AUDIO_I2S_CLOCK: WL-FPGA (U4.136), WL-CPU (U1.66), WL-AUDIO (U9.25)
BPF_A: WL-FPGA (U4.80), WL-BPF (U24.14 U25.14 U26.14 U27.14)
BPF_B: WL-FPGA (U4.83), WL-BPF (U24.2 U25.2 U26.2 U27.2)
BPF_OE1: WL-FPGA (U4.77), WL-BPF (U24.1 U24.15 U26.1 U26.15)
BPF_OE2: WL-FPGA (U4.84), WL-BPF (U25.1 U25.15 U27.1 U27.15)
CPU_PW: WL-POWER (C125.1 VD1.2), WL-CPU (U1.93)
CPU_PW_HOLD: WL-POWER (VT6.1), WL-CPU (U1.92)
D_N: WL-CPU (U1.70), WL-CONNECT (R48.2)
D_P: WL-CPU (U1.71), WL-CONNECT (R49.2)
FPGA_48K_CLK: WL-FPGA (U4.135), WL-CPU (U1.47)
FPGA_BUS_CLK: WL-FPGA (U4.33), WL-CPU (U1.17)
FPGA_BUS_D0: WL-FPGA (U4.49), WL-CPU (U1.23)
FPGA_BUS_D1: WL-FPGA (U4.50), WL-CPU (U1.24)
FPGA_BUS_D2: WL-FPGA (U4.51), WL-CPU (U1.25)
FPGA_BUS_D3: WL-FPGA (U4.38), WL-CPU (U1.26)
FPGA_BUS_D4: WL-FPGA (U4.39), WL-CPU (U1.29)
FPGA_BUS_D5: WL-FPGA (U4.42), WL-CPU (U1.30)
FPGA_BUS_D6: WL-FPGA (U4.43), WL-CPU (U1.31)
FPGA_BUS_D7: WL-FPGA (U4.46), WL-CPU (U1.32)
FPGA_BUS_SYNC: WL-FPGA (U4.32), WL-CPU (U1.18)
IN_B1: WL-BPF (U24.6 U24.10), WL-BPF_L (L6.1)
IN_B2: WL-BPF (U24.5 U24.11), WL-BPF_L (L7.1)
IN_B3: WL-BPF (U24.4 U24.12), WL-BPF_L (L8.1)
IN_B4: WL-BPF (U24.3 U24.13), WL-BPF_L (L9.1)
IN_B5: WL-BPF (U25.6 U25.10), WL-BPF_L (L18.1)
IN_B6: WL-BPF (U25.5 U25.11), WL-BPF_L (L19.1)
IN_B7: WL-BPF (U25.4 U25.12), WL-BPF_L (L20.1)
IN_LPE: WL-ATT (U23.14), WL-BPF (C139.1)
IN_RX: WL-ADC (T1.4), WL-BPF (C134.1)
KEY_IN_DASH: WL-CPU (U1.97), WL-CONNECT (XP11.2)
KEY_IN_DOT: WL-CPU (U1.98), WL-CONNECT (XP11.1)
LPF1: WL-FPGA (U4.76), WL-CONTROL (U11.1)
LPF2: WL-FPGA (U4.75), WL-CONTROL (U11.2)
LPF3: WL-FPGA (U4.74), WL-CONTROL (U11.3)
LTC_ENABLE: WL-ADC (U5.11), WL-FPGA (U4.69)
MIC: WL-AUDIO (C66.2 C67.1 R33.2 R36.2), WL-CONNECT (XP9.2)
Net-bit1: WL-ADC (U6.13), WL-FPGA (RN1.1)
Net-bit2: WL-ADC (U6.12), WL-FPGA (RN1.2)
Net-bit3: WL-ADC (U6.11), WL-FPGA (RN1.3)
Net-bit4: WL-ADC (U6.10), WL-FPGA (RN1.4)
Net-bit5: WL-ADC (U6.9), WL-FPGA (RN2.1)
Net-bit6: WL-ADC (U6.8), WL-FPGA (RN2.2)
Net-bit7: WL-ADC (U6.7), WL-FPGA (RN2.3)
Net-bit8: WL-ADC (U6.6), WL-FPGA (RN2.4)
Net-bit9: WL-ADC (U6.5), WL-FPGA (RN3.1)
Net-bit10: WL-ADC (U6.4), WL-FPGA (RN3.2)
Net-bit11: WL-ADC (U6.3), WL-FPGA (RN3.3)
Net-bit12: WL-ADC (U6.2), WL-FPGA (RN3.4)
Net-Clock: WL-ADC (C33.2 U6.1), WL-FPGA (U4.89)
Net-otr: WL-ADC (U6.14), WL-FPGA (U4.44)
Net_DAC0: WL-FPGA (U4.101), WL-DAC (U7.14)
Net_DAC1: WL-FPGA (U4.103), WL-DAC (U7.13)
Net_DAC2: WL-FPGA (U4.104), WL-DAC (U7.12)
Net_DAC3: WL-FPGA (U4.105), WL-DAC (U7.11)
Net_DAC4: WL-FPGA (U4.106), WL-DAC (U7.10)
Net_DAC5: WL-FPGA (U4.110), WL-DAC (U7.9)
Net_DAC6: WL-FPGA (U4.111), WL-DAC (U7.8)
Net_DAC7: WL-FPGA (U4.112), WL-DAC (U7.7)
Net_DAC8: WL-FPGA (U4.113), WL-DAC (U7.6)
Net_DAC9: WL-FPGA (U4.114), WL-DAC (U7.5)
Net_DAC10: WL-FPGA (U4.115), WL-DAC (U7.4)
Net_DAC11: WL-FPGA (U4.119), WL-DAC (U7.3)
Net_DAC12: WL-FPGA (U4.120), WL-DAC (U7.2)
Net_DAC13: WL-FPGA (U4.121), WL-DAC (U7.1)
Net_DAC-CLK: WL-FPGA (U4.125), WL-DAC (U7.28)
Net_DAC-PD: WL-FPGA (U4.124), WL-DAC (R15.2 U7.15)
NetC131_1: WL-ATT (C131.1), WL-CONTROL (XW2.1)
NetT4_3: WL-DAC (T4.3), WL-CONTROL (XW1.1)
ON/OFF: WL-POWER (VD1.3), WL-CPU (XP1.36)
OUT_B1: WL-BPF (U26.6 U26.10), WL-BPF_L (L16.2)
OUT_B2: WL-BPF (U26.5 U26.11), WL-BPF_L (L14.2)
OUT_B3: WL-BPF (U26.4 U26.12), WL-BPF_L (L17.2)
OUT_B4: WL-BPF (U26.3 U26.13), WL-BPF_L (L15.2)
OUT_B5: WL-BPF (U27.6 U27.10), WL-BPF_L (L24.2)
OUT_B6: WL-BPF (U27.5 U27.11), WL-BPF_L (L25.2)
OUT_B7: WL-BPF (U27.4 U27.12), WL-BPF_L (L26.2)
PA13: WL-FPGA (XP2.6), WL-CPU (U1.72)
PA14: WL-FPGA (XP2.8), WL-CPU (U1.76)
PTT: WL-CPU (U1.37), WL-CONNECT (C130.2 R50.2 VD2.3)
PTT_SW1: WL-CPU (U1.35), WL-CONNECT (U21.3 U21.4)
PTT_SW2: WL-CPU (U1.36), WL-CONNECT (U22.3 U22.4)
RX/TX: WL-FPGA (U4.72), WL-DAC (VT2.1), WL-CONTROL (VT4.1)
SWR_BACKW: WL-CPU (U1.16), WL-CONNECT (XP12.2)
SWR_FORW: WL-CPU (U1.15), WL-CONNECT (XP12.3)
WM8731_ADC_SD: WL-CPU (U1.79), WL-AUDIO (U9.6)
WM8731_BCLK: WL-CPU (U1.78), WL-AUDIO (U9.3)
WM8731_DAC_SD: WL-CPU (U1.80), WL-AUDIO (U9.4)
WM8731_SCK: WL-CPU (U1.84), WL-AUDIO (R29.2 U9.24)
WM8731_SDA: WL-CPU (U1.87), WL-AUDIO (R30.2 U9.23)
WM8731_WS_LRC: WL-CPU (U1.77), WL-AUDIO (U9.5 U9.7)